# EasyEDA Pro project SAKANA_PCB.epro

# Schematic INA219
Board Name: INA219; Create Date: 2024-12-30; Page Name: P1; Project Name: SAKANA; Schematic Name: INA219; Update Date: 2024-12-30; Company: BSJ INSTRUMENT; Page Size: A5; Version: V1.0
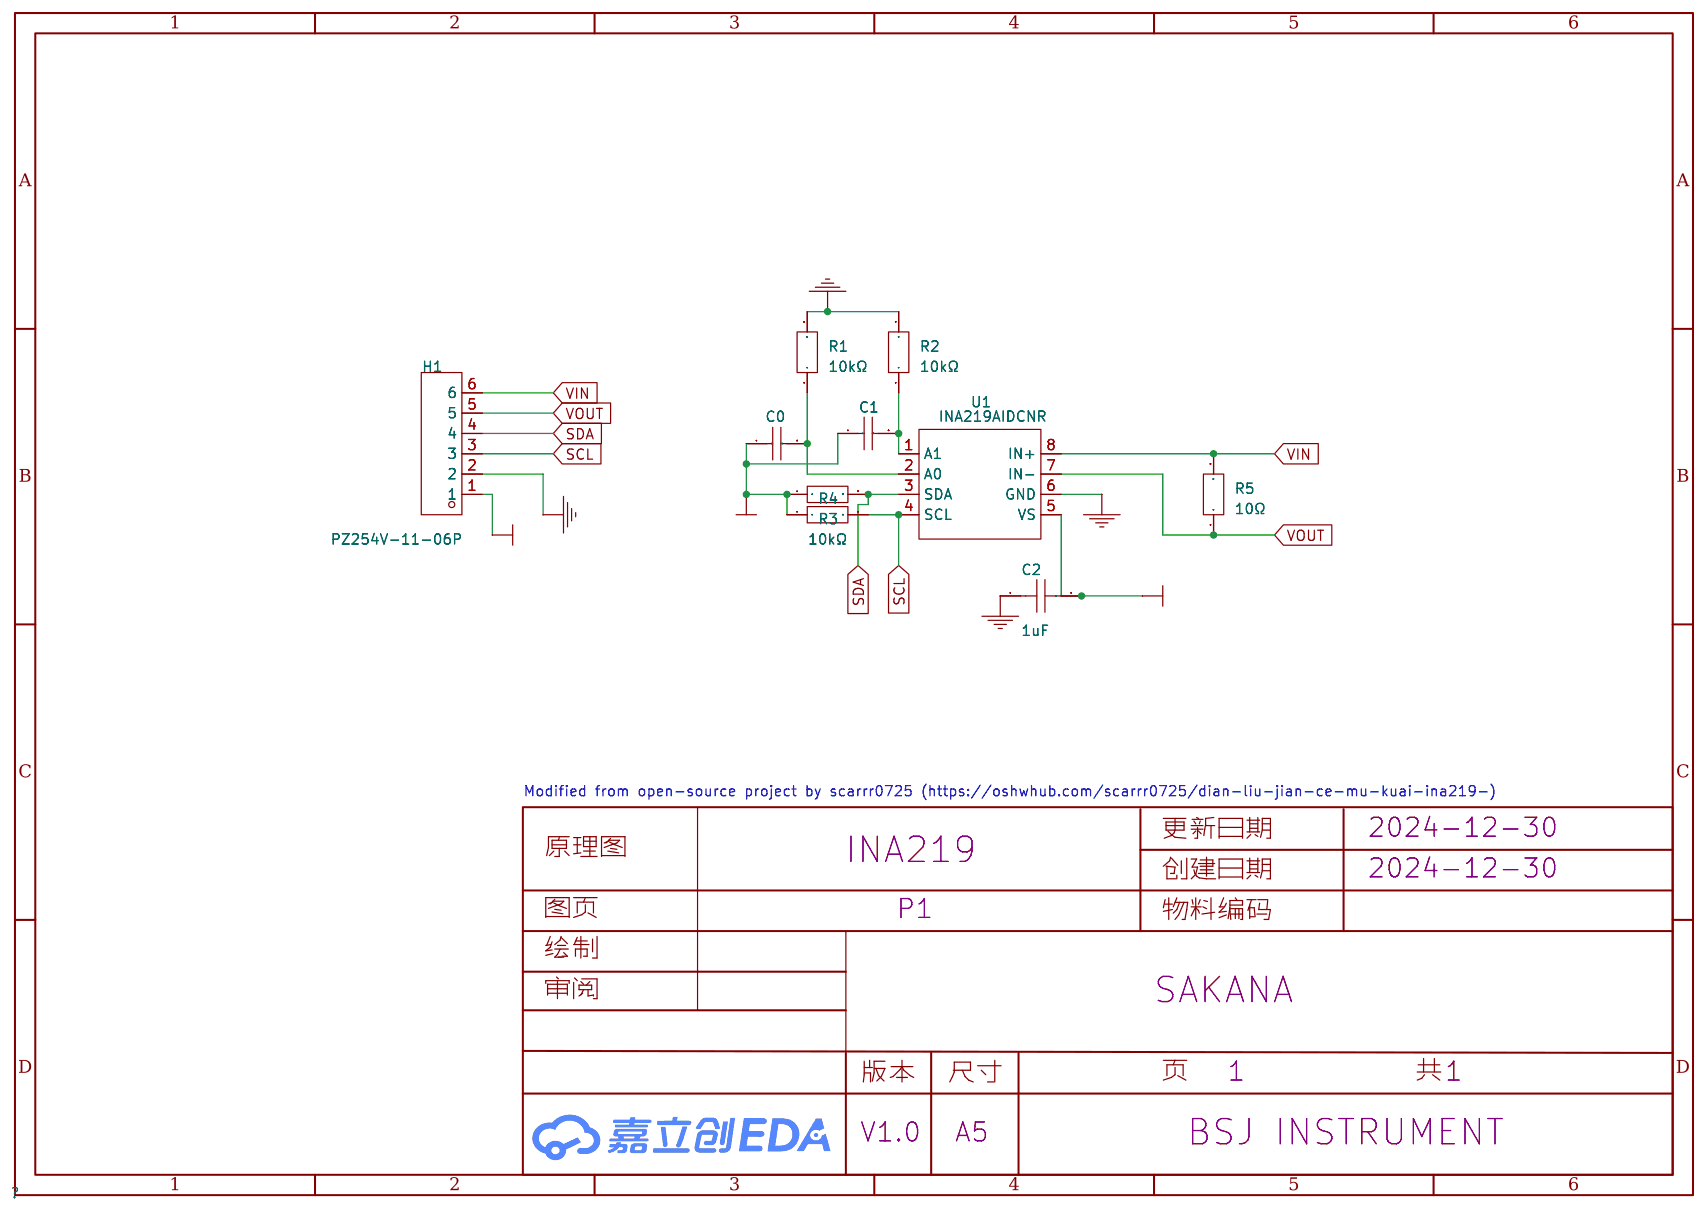
[diagram p0: schematic sheet]

## Parts
C0  1uF  [CAP-TH_L8.5-W5.0-P5.00-D1.2]
C1  1uF  [CAP-TH_L8.5-W5.0-P5.00-D1.2]
C2  1uF  [CAP-TH_L8.5-W5.0-P5.00-D1.2]
H1  PZ254V-11-06P  [HDR-TH_6P-P2.54-V-M]
R1  10kΩ  [RES-TH_BD2.7-L6.2-P10.20-D0.4]
R2  10kΩ  [RES-TH_BD2.7-L6.2-P10.20-D0.4]
R3  10kΩ  [RES-TH_BD2.7-L6.2-P10.20-D0.4]
R4  10K  [RES-TH_BD2.7-L6.2-P10.20-D0.4]
R5  10Ω  [RES-TH_BD2.7-L6.2-P10.20-D0.4]
U1  INA219AIDCNR  [SOIC-8_L4.9-W3.9-P1.27-LS6.0-BL]

## Library data of the parts
C0 C1 = 1uF: Supplier: LCSC; Manufacturer Part: CL10A105KB8NNNC; Manufacturer: SAMSUNG; Supplier Part: C15849; JLCPCB Part Class: Basic
C2 = CT4-0805B104K500F3: 容值:100nF;精度:±10%;额定电压:50V;温度系数:X7R;; LCSC Part Name: 100nF ±10% 50V C3型（直脚）; Supplier Part: C84772; Manufacturer: FH(风华); Supplier Footprint: 插件,P=5.08mm; JLCPCB Part Class: 扩展库; Datasheet: https://atta.szlcsc.com/upload/public/pdf/source/20190402/C385200_059806A6312B28FF1421A2413EB641E1.pdf; Supplier: LCSC; Tolerance: ±10%; Voltage Rated: 50V; Temperature Coefficient: X7R
H1 = PZ254V-11-06P: 插针结构:1x6P;间距:2.54mm;行距:-;圆针/方针:方针;安装类型:直插;排数:单排;总PIN位数:6P;额定电流:-;额定电压:-;配合针长度:6mm;塑高:2.5mm;端接针长度:3mm;触头材质:黄铜;触头镀层:-;工作温度范围:-40℃~+105℃;颜色:黑色;; LCSC Part Name: 间距:2.54mm 1x6P 直插 方针; Supplier Part: C492405; Manufacturer: XFCN(兴飞); Supplier Footprint: 插件,P=2.54mm; JLCPCB Part Class: 扩展库; Datasheet: https://atta.szlcsc.com/upload/public/pdf/source/20200309/C492405_597F1930F5B55CC3C7FD95458F1C3977.pdf; Supplier: LCSC; Pin Structure: 1x6P; Pitch: 2.54mm; Circluar Pins/Square Pins: 方针; Mounting Type: 直插; Number of Rows: 单排; Number of Pins: 6P; Length of Mating Pin: 6mm; Insulation Height: 2.5mm; Length of End Connection Pin: 3mm; Contact Material: 黄铜; Operating Temperature Range: -40℃~+105℃; Color: 黑色
R1 R2 R5 = MF1/4W-1K±1%-ST52: 电阻类型:金属膜电阻;阻值:1kΩ;精度:±1%;功率:250mW;温度系数:±100ppm/℃;; LCSC Part Name: 金属膜电阻 1kΩ ±1% 250mW; Supplier Part: C2903245; Manufacturer: VO(翔胜); Supplier Footprint: 插件,D2.7xL6.2mm; JLCPCB Part Class: 扩展库; Datasheet: https://atta.szlcsc.com/upload/public/pdf/source/20200609/C601728_5AA4C0C8E12E11069DA2C3356F29D1F2.pdf; Supplier: LCSC; Type: 金属膜电阻; Tolerance: ±1%; Overload Voltage (Max): 250V; Power(Watts): 250mW; Temperature Coefficient: ±100ppm/℃; Operating Temperature Range: -55℃~+155℃
R3 R4 = 10K: Supplier: LCSC; Manufacturer Part: TC0325B1002T5E; Manufacturer: UniOhm; Supplier Part: C39050; JLCPCB Part Class: Extend
U1 = INA219AIDCNR: Supplier: LCSC; Manufacturer: TI; Supplier Part: C87469; JLCPCB Part Class: Extend

## Nets
+5V: C0.1 C1.1 C2.2 H1.1 R3.1 R4.1 U1.5(VS)
GND: C2.1 H1.2 R1.2 R2.2 U1.6(GND)
VIN: H1.6 R5.2 U1.8(IN+)
SCL: H1.3 R3.2 U1.4(SCL)
SDA: H1.4 R4.2 U1.3(SDA)
VOUT: H1.5 R5.1 U1.7(IN-)
Net-(C0-2): C0.2 R1.1 U1.2(A0)
Net-(C1-2): C1.2 R2.1 U1.1(A1)

## Notes on the sheet
- Modified from open-source project by scarrr0725 (https://oshwhub.com/scarrr0725/dian-liu-jian-ce-mu-kuai-ina219-)

# Schematic Main
Board Name: Main; Create Date: 2024-12-29; Page Name: P1; Project Name: SAKANA; Schematic Name: Main; Update Date: 2025-02-17; Company: BSJ INSTRUMENT; Page Size: A4; Version: V1.0
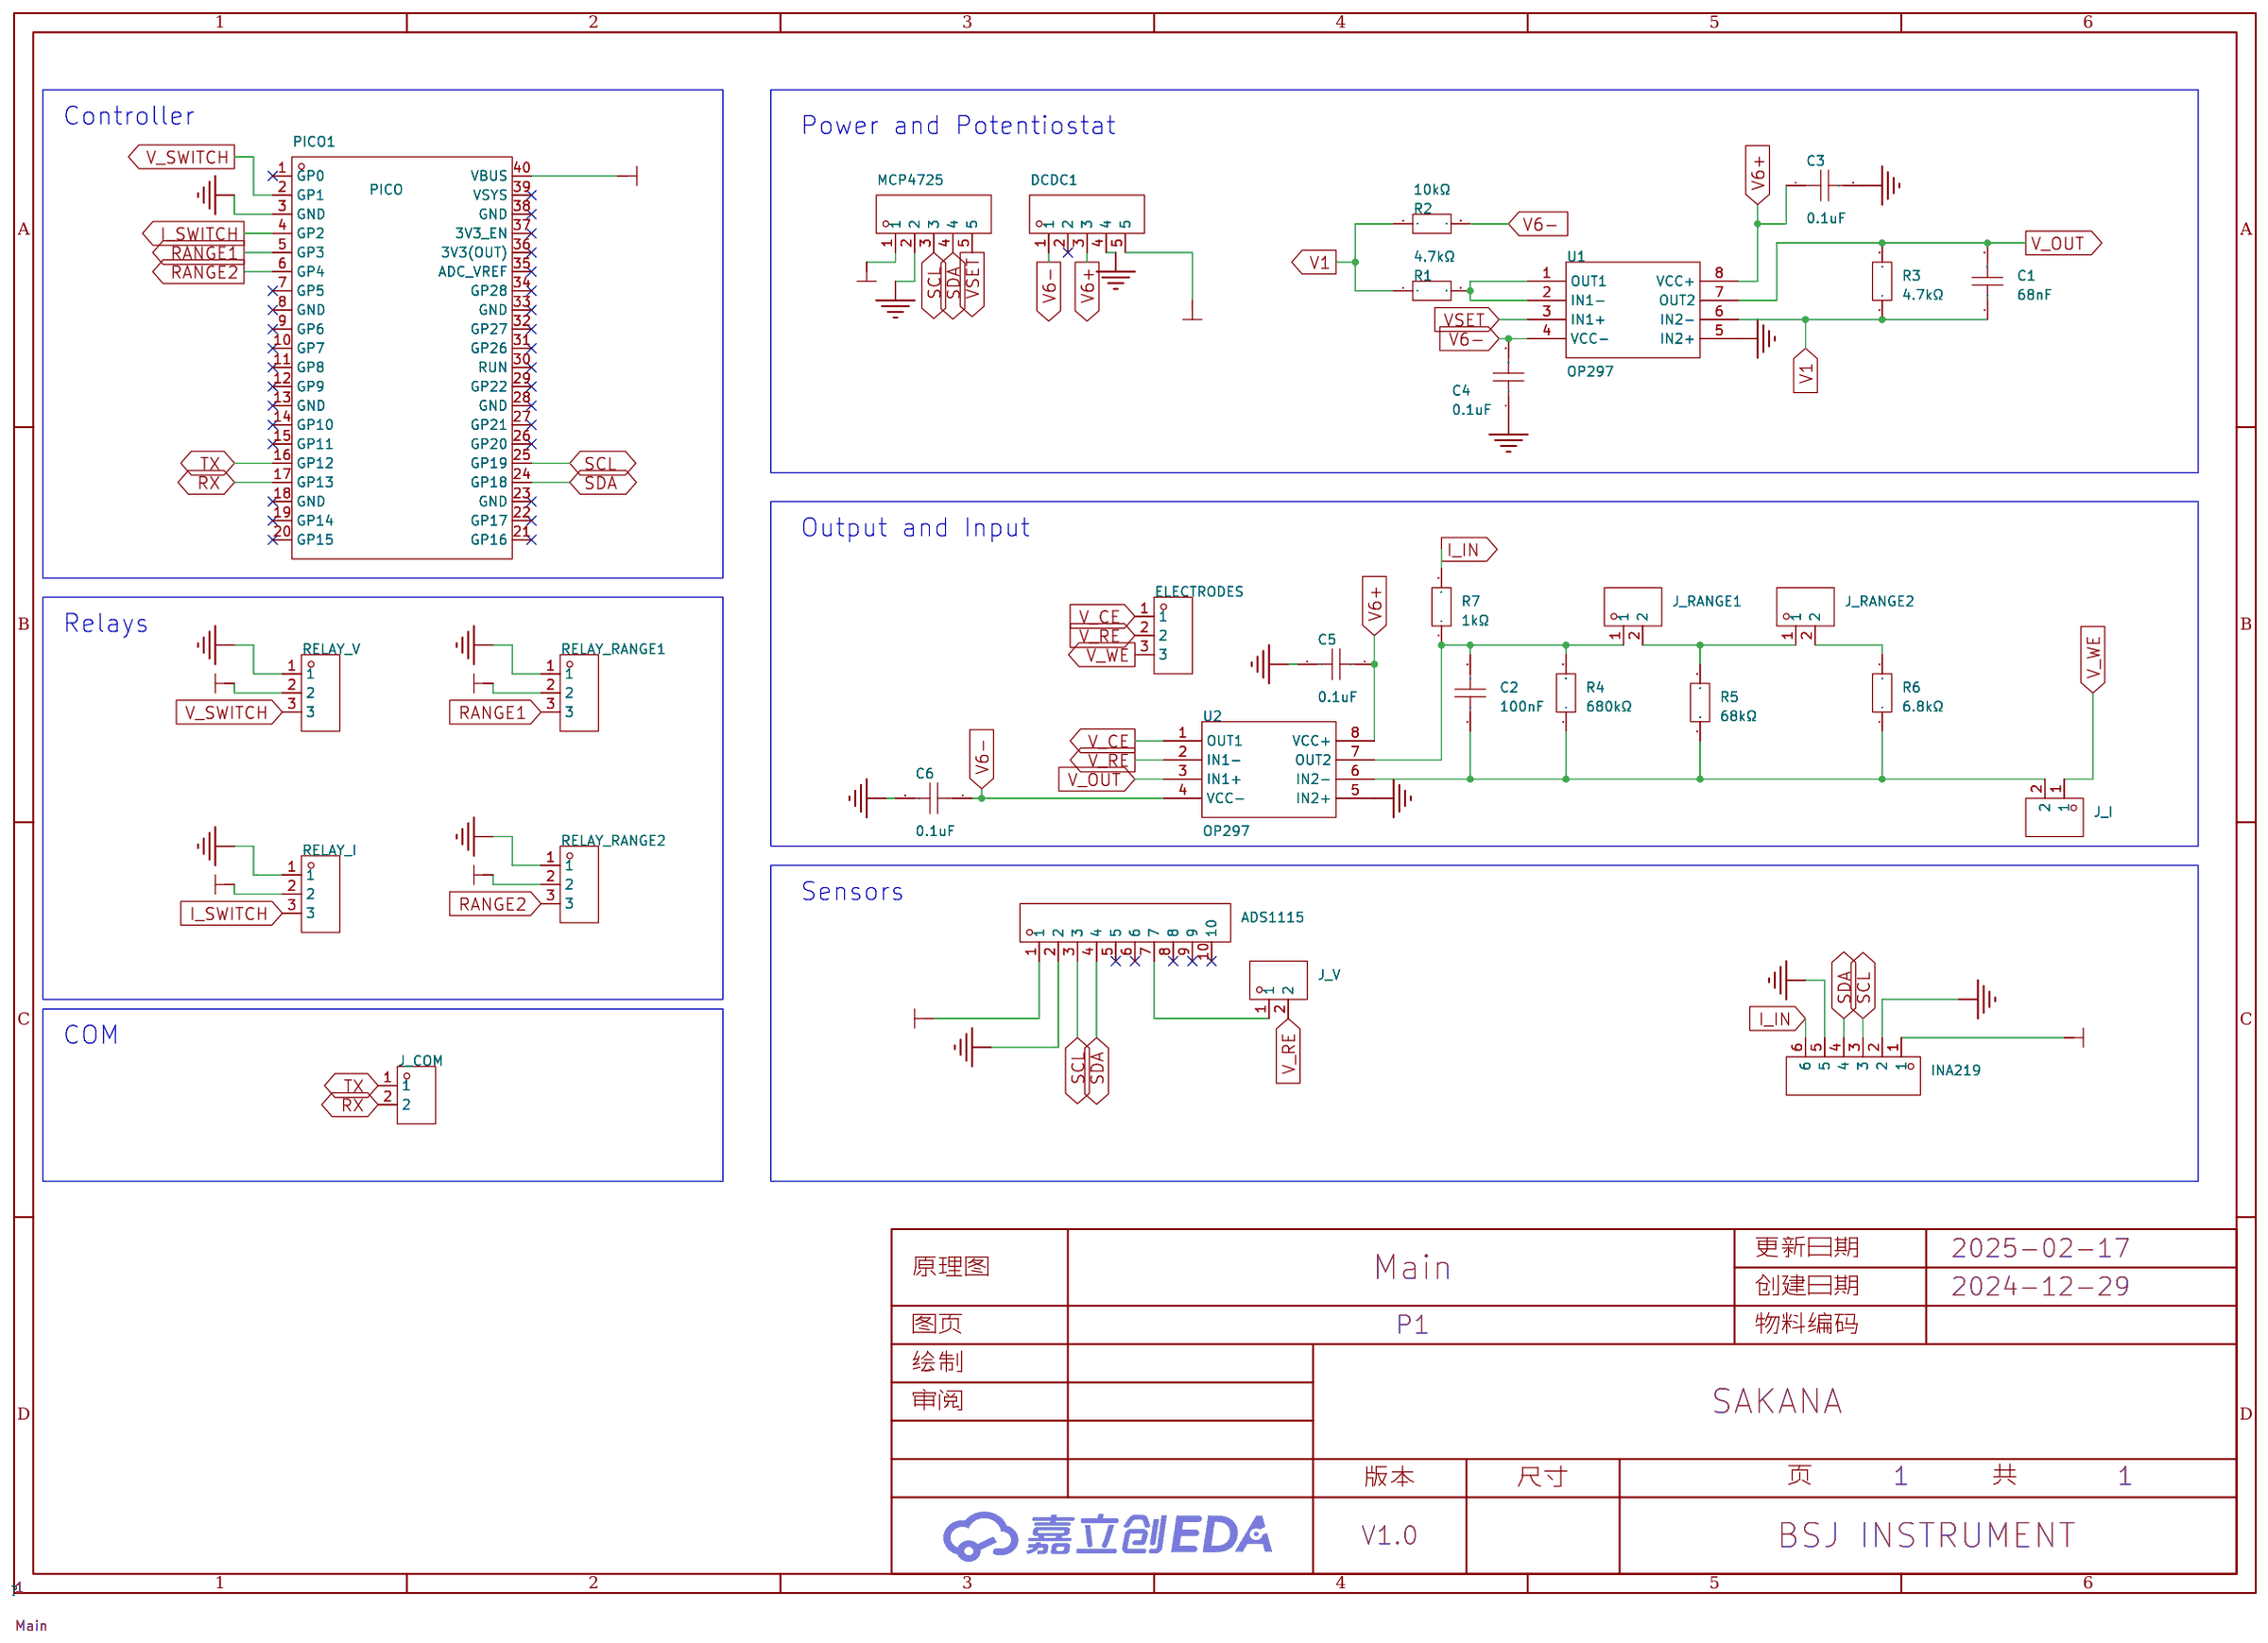
[diagram p1: schematic sheet]

## Parts
ADS1115  HDR1X10  [ADS1115Module]
C1  68nF  [CAP-TH_L10.0-W2.5-P5.15-D0.8]
C2  100nF  [CAP-TH_L10.0-W2.5-P5.15-D0.8]
C3  0.1uF  [CAP-TH_L10.0-W2.5-P5.15-D0.8]
C4  0.1uF  [CAP-TH_L10.0-W2.5-P5.15-D0.8]
C5  0.1uF  [CAP-TH_L10.0-W2.5-P5.15-D0.8]
C6  0.1uF  [CAP-TH_L10.0-W2.5-P5.15-D0.8]
DCDC1  PZ254V-11-05P  [DCDCModule]
ELECTRODES  排母2.54mm 1X3pin  [HDR-TH_3P-P2.54_CS-1165SDIG]
INA219  KH-2.54FH90-1X6P-H8.5  [INA219Module]
J_COM  HDR1X2  [HDR-TH_2P-P2.54-V-M-1]
J_I  HDR1X2  [HDR-TH_2P-P2.54-V-M-1]
J_RANGE1  HDR1X2  [HDR-TH_2P-P2.54-V-M-1]
J_RANGE2  HDR1X2  [HDR-TH_2P-P2.54-V-M-1]
J_V  HDR1X2  [HDR-TH_2P-P2.54-V-M-1]
MCP4725  PZ254V-11-05P  [MCP4725Module]
PICO1  PICO  [PICO直插]
R1  4.7kΩ  [RES-TH_BD2.7-L6.2-P10.20-D0.4]
R2  10kΩ  [RES-TH_BD2.7-L6.2-P10.20-D0.4]
R3  4.7kΩ  [RES-TH_BD2.7-L6.2-P10.20-D0.4]
R4  680kΩ  [RES-TH_BD2.7-L6.2-P10.20-D0.4]
R5  68kΩ  [RES-TH_BD2.7-L6.2-P10.20-D0.4]
R6  6.8kΩ  [RES-TH_BD2.7-L6.2-P10.20-D0.4]
R7  1kΩ  [RES-TH_BD2.7-L6.2-P10.20-D0.4]
RELAY_I  排母2.54mm 1X3pin  [RELAYModule]
RELAY_RANGE1  排母2.54mm 1X3pin  [RELAYModule]
RELAY_RANGE2  排母2.54mm 1X3pin  [RELAYModule]
RELAY_V  排母2.54mm 1X3pin  [RELAYModule]
U1  OP297  [PDIP-8_L9.6-W6.4-P2.54-LS7.6-BL-1]
U2  OP297  [PDIP-8_L9.6-W6.4-P2.54-LS7.6-BL-1]

## Library data of the parts
ADS1115 = HDR1X10: Supplier Part: C9900008052; Supplier Footprint: 1X10P2.54mm塑高3.5mm; JLCPCB Part Class: 扩展库; Supplier: LCSC
C1-C6 = CC1H104ZA1FD3F6C1100: 容值:100nF;精度:-20%~+80%;额定电压:50V;温度系数:Y5V;; LCSC Part Name: 100nF -20%~+80% 50V; Supplier Part: C5442939; Manufacturer: Dersonic(德尔创); Supplier Footprint: 插件,P=2.54mm; JLCPCB Part Class: 扩展库; Datasheet: https://atta.szlcsc.com/upload/public/pdf/source/20240808/2E4F22AECAD8A963CB56DA9A5AABDB6C.pdf; Supplier: LCSC; Tolerance: -20%~+80%; Voltage Rated: 50V; Lead Spacing: 2.54mm; Temperature Coefficient: Y5V; Diameter: 6.3mm; Body Thickness: 2.6mm
DCDC1 MCP4725 = PZ254V-11-05P: 插针结构:1x5P;间距:2.54mm;行距:-;圆针/方针:方针;安装类型:直插;排数:单排;总PIN位数:5P;额定电流:-;额定电压:-;配合针长度:6mm;塑高:2.5mm;端接针长度:3mm;触头材质:黄铜;触头镀层:-;工作温度范围:-40℃~+105℃;颜色:黑色;; LCSC Part Name: 间距:2.54mm 1x5P 直插 方针; Supplier Part: C492404; Manufacturer: XFCN(兴飞); Supplier Footprint: 插件,P=2.54mm; JLCPCB Part Class: 扩展库; Datasheet: https://atta.szlcsc.com/upload/public/pdf/source/20200309/C492404_E51533260F8710EFF5D4617281164C1D.pdf; Supplier: LCSC; Pin Structure: 1x5P; Pitch: 2.54mm; Circluar Pins/Square Pins: 方针; Mounting Type: 直插; Number of Rows: 单排; Number of Pins: 5P; Length of Mating Pin: 6mm; Insulation Height: 2.5mm; Length of End Connection Pin: 3mm; Contact Material: 黄铜; Operating Temperature Range: -40℃~+105℃; Color: 黑色
ELECTRODES RELAY_I RELAY_RANGE1 RELAY_RANGE2 RELAY_V = 排母2.54mm 1X3pin: Supplier Part: C9900016709; JLCPCB Part Class: 扩展库; Supplier: LCSC
INA219 = KH-2.54FH90-1X6P-H8.5: 插孔结构:1x6P;间距:2.54mm;行距:-;圆孔/方孔:方孔;安装类型:弯插;排数:单排;总孔位数:6P;额定电流:3A;额定电压:-;插孔方向:侧面;塑高:8.5mm;工作温度范围:-40℃~+105℃;; LCSC Part Name: 间距:2.54mm 1x6P 弯插; Supplier Part: C2932681; Manufacturer: kinghelm(金航标); Supplier Footprint: 弯插,P=2.54mm; JLCPCB Part Class: 扩展库; Datasheet: https://atta.szlcsc.com/upload/public/pdf/source/20211220/525C1B6496826BAEA2630695935DC58D.pdf; Supplier: LCSC; Holes Structure: 1x6P; Pitch: 2.54mm; Circular Hole / Square Hole: 方孔; Mounting Type: 弯插; Number of Rows: 单排; Number of Holes: 6P; Current Rating (Max): 3A; Holes Direction: 侧面; Insulation Height: 8.5mm; Operating Temperature Range: -40℃~+105℃
J_COM J_I J_RANGE1 J_RANGE2 J_V = HDR1X2: Supplier Part: C9900014921; Supplier Footprint: 排针; JLCPCB Part Class: 扩展库; Supplier: LCSC
PICO1 = PICO: "基于Raspberry Pi RP2040芯片设计；处理器：双核Arm Cortex-M0+ @ 133MHz内存：264KB片上SRAM；2MB板上QSPI闪存接口：26个GPIO引脚，包括3个模拟输入；2 × UART；2 × SPI控制器；2 × I2C控制器；16个PWM通道；1 × USB 1.1控制器和PHY，支持主机和设备；8 × PIO状态机"; Supplier Part: C7203002; Manufacturer: Raspberry Pi(树莓派); JLCPCB Part Class: 扩展库; Datasheet: https://atta.szlcsc.com/upload/public/pdf/source/20230906/086376002DDC9866828648BC93E51F8B.pdf; Supplier: LCSC
R1-R7 = MF1/4W-1K±1%-ST52: 电阻类型:金属膜电阻;阻值:1kΩ;精度:±1%;功率:250mW;温度系数:±100ppm/℃;; LCSC Part Name: 金属膜电阻 1kΩ ±1% 250mW; Supplier Part: C2903245; Manufacturer: VO(翔胜); Supplier Footprint: 插件,D2.7xL6.2mm; JLCPCB Part Class: 扩展库; Datasheet: https://atta.szlcsc.com/upload/public/pdf/source/20200609/C601728_5AA4C0C8E12E11069DA2C3356F29D1F2.pdf; Supplier: LCSC; Type: 金属膜电阻; Tolerance: ±1%; Overload Voltage (Max): 250V; Power(Watts): 250mW; Temperature Coefficient: ±100ppm/℃; Operating Temperature Range: -55℃~+155℃
U1 U2 = NE5532PE4: 放大器数:双路;增益带宽积(GBP):10MHz;输入偏置电流(Ib):200nA;压摆率(SR):9V/us;带宽(-3db):-;; Supplier Part: C1347122; Manufacturer: TI(德州仪器); Supplier Footprint: PDIP-8; JLCPCB Part Class: 扩展库; Datasheet: https://www.ti.com/cn/lit/gpn/sa5532; Supplier: LCSC; Number of Circuits: 双路; Gain Bandwidth Product(GBP): 10MHz; Current - Input Bias(Ib): 200nA; Slew Rate(SR): 9V/us; Output Current: 38mA; Operating Temperature: 0℃~+70℃

## Nets
GND: ADS1115.2 C3.2 C4.1 C5.2 C6.2 DCDC1.4 INA219.2 INA219.5 MCP4725.2 PICO1.3(GND) RELAY_I.1 RELAY_RANGE1.1 RELAY_RANGE2.1 RELAY_V.1 U1.5(IN2+) U2.5(IN2+)
V1: C1.1 R1.1 R2.1 R3.1 U1.6(IN2-)
V6+: C3.1 C5.1 DCDC1.3 U1.8(VCC+) U2.8(VCC+)
V6-: C4.2 C6.1 DCDC1.1 R2.2 U1.4(VCC-) U2.4(VCC-)
VCC: ADS1115.1 DCDC1.5 INA219.1 MCP4725.1 PICO1.40(VBUS) RELAY_I.2 RELAY_RANGE1.2 RELAY_RANGE2.2 RELAY_V.2
I_IN: INA219.6 R7.2
I_SWITCH: PICO1.4(GP2) RELAY_I.3
RANGE1: PICO1.5(GP3) RELAY_RANGE1.3
RANGE2: PICO1.6(GP4) RELAY_RANGE2.3
RX: J_COM.2 PICO1.17(GP13)
SCL: ADS1115.3 INA219.3 MCP4725.3 PICO1.25(GP19)
SDA: ADS1115.4 INA219.4 MCP4725.4 PICO1.24(GP18)
TX: J_COM.1 PICO1.16(GP12)
V_CE: ELECTRODES.1 U2.1(OUT1)
V_OUT: C1.2 R3.2 U1.7(OUT2) U2.3(IN1+)
V_RE: ELECTRODES.2 J_V.2 U2.2(IN1-)
V_SWITCH: PICO1.2(GP1) RELAY_V.3
V_WE: ELECTRODES.3 J_I.1
VSET: MCP4725.5 U1.3(IN1+)
$1N2928: R1.2 U1.1(OUT1) U1.2(IN1-)
$1N3893: C2.1 J_I.2 R4.1 R5.2 R6.1 U2.6(IN2-)
$1N3984: C2.2 J_RANGE1.1 R4.2 R7.1 U2.7(OUT2)
$1N5030: ADS1115.7 J_V.1
$1N11195: J_RANGE1.2 J_RANGE2.1 R5.1
$1N11201: J_RANGE2.2 R6.2

Not connected (* = marked no-connect by the designer): ADS1115 5* 6* 8* 9* 10*; DCDC1 2*; PICO1 1(GP0)* 7(GP5)* 8(GND)* 9(GP6)* 10(GP7)* 11(GP8)* 12(GP9)* 13(GND)* 14(GP10)* 15(GP11)* 18(GND)* 19(GP14)* 20(GP15)* 21(GP16)* 22(GP17)* 23(GND)* 26(GP20)* 27(GP21)* 28(GND)* 29(GP22)* 30(RUN)* 31(GP26)* 32(GP27)* 33(GND)* 34(GP28)* 35(ADC_VREF)* 36(3V3(OUT))* 37(3V3_EN)* 38(GND)* 39(VSYS)*

## Notes on the sheet
- Controller
- Power and Potentiostat
- Output and Input
- Relays
- Sensors
- COM

# Schematic Main_3
Board Name: LDO_v2; Create Date: 2025-10-01; Page Name: P1; Project Name: SAKANA; Schematic Name: Main_3; Update Date: 2025-11-12; Company: BSJ INSTRUMENT; Page Size: A4; Version: V1.0
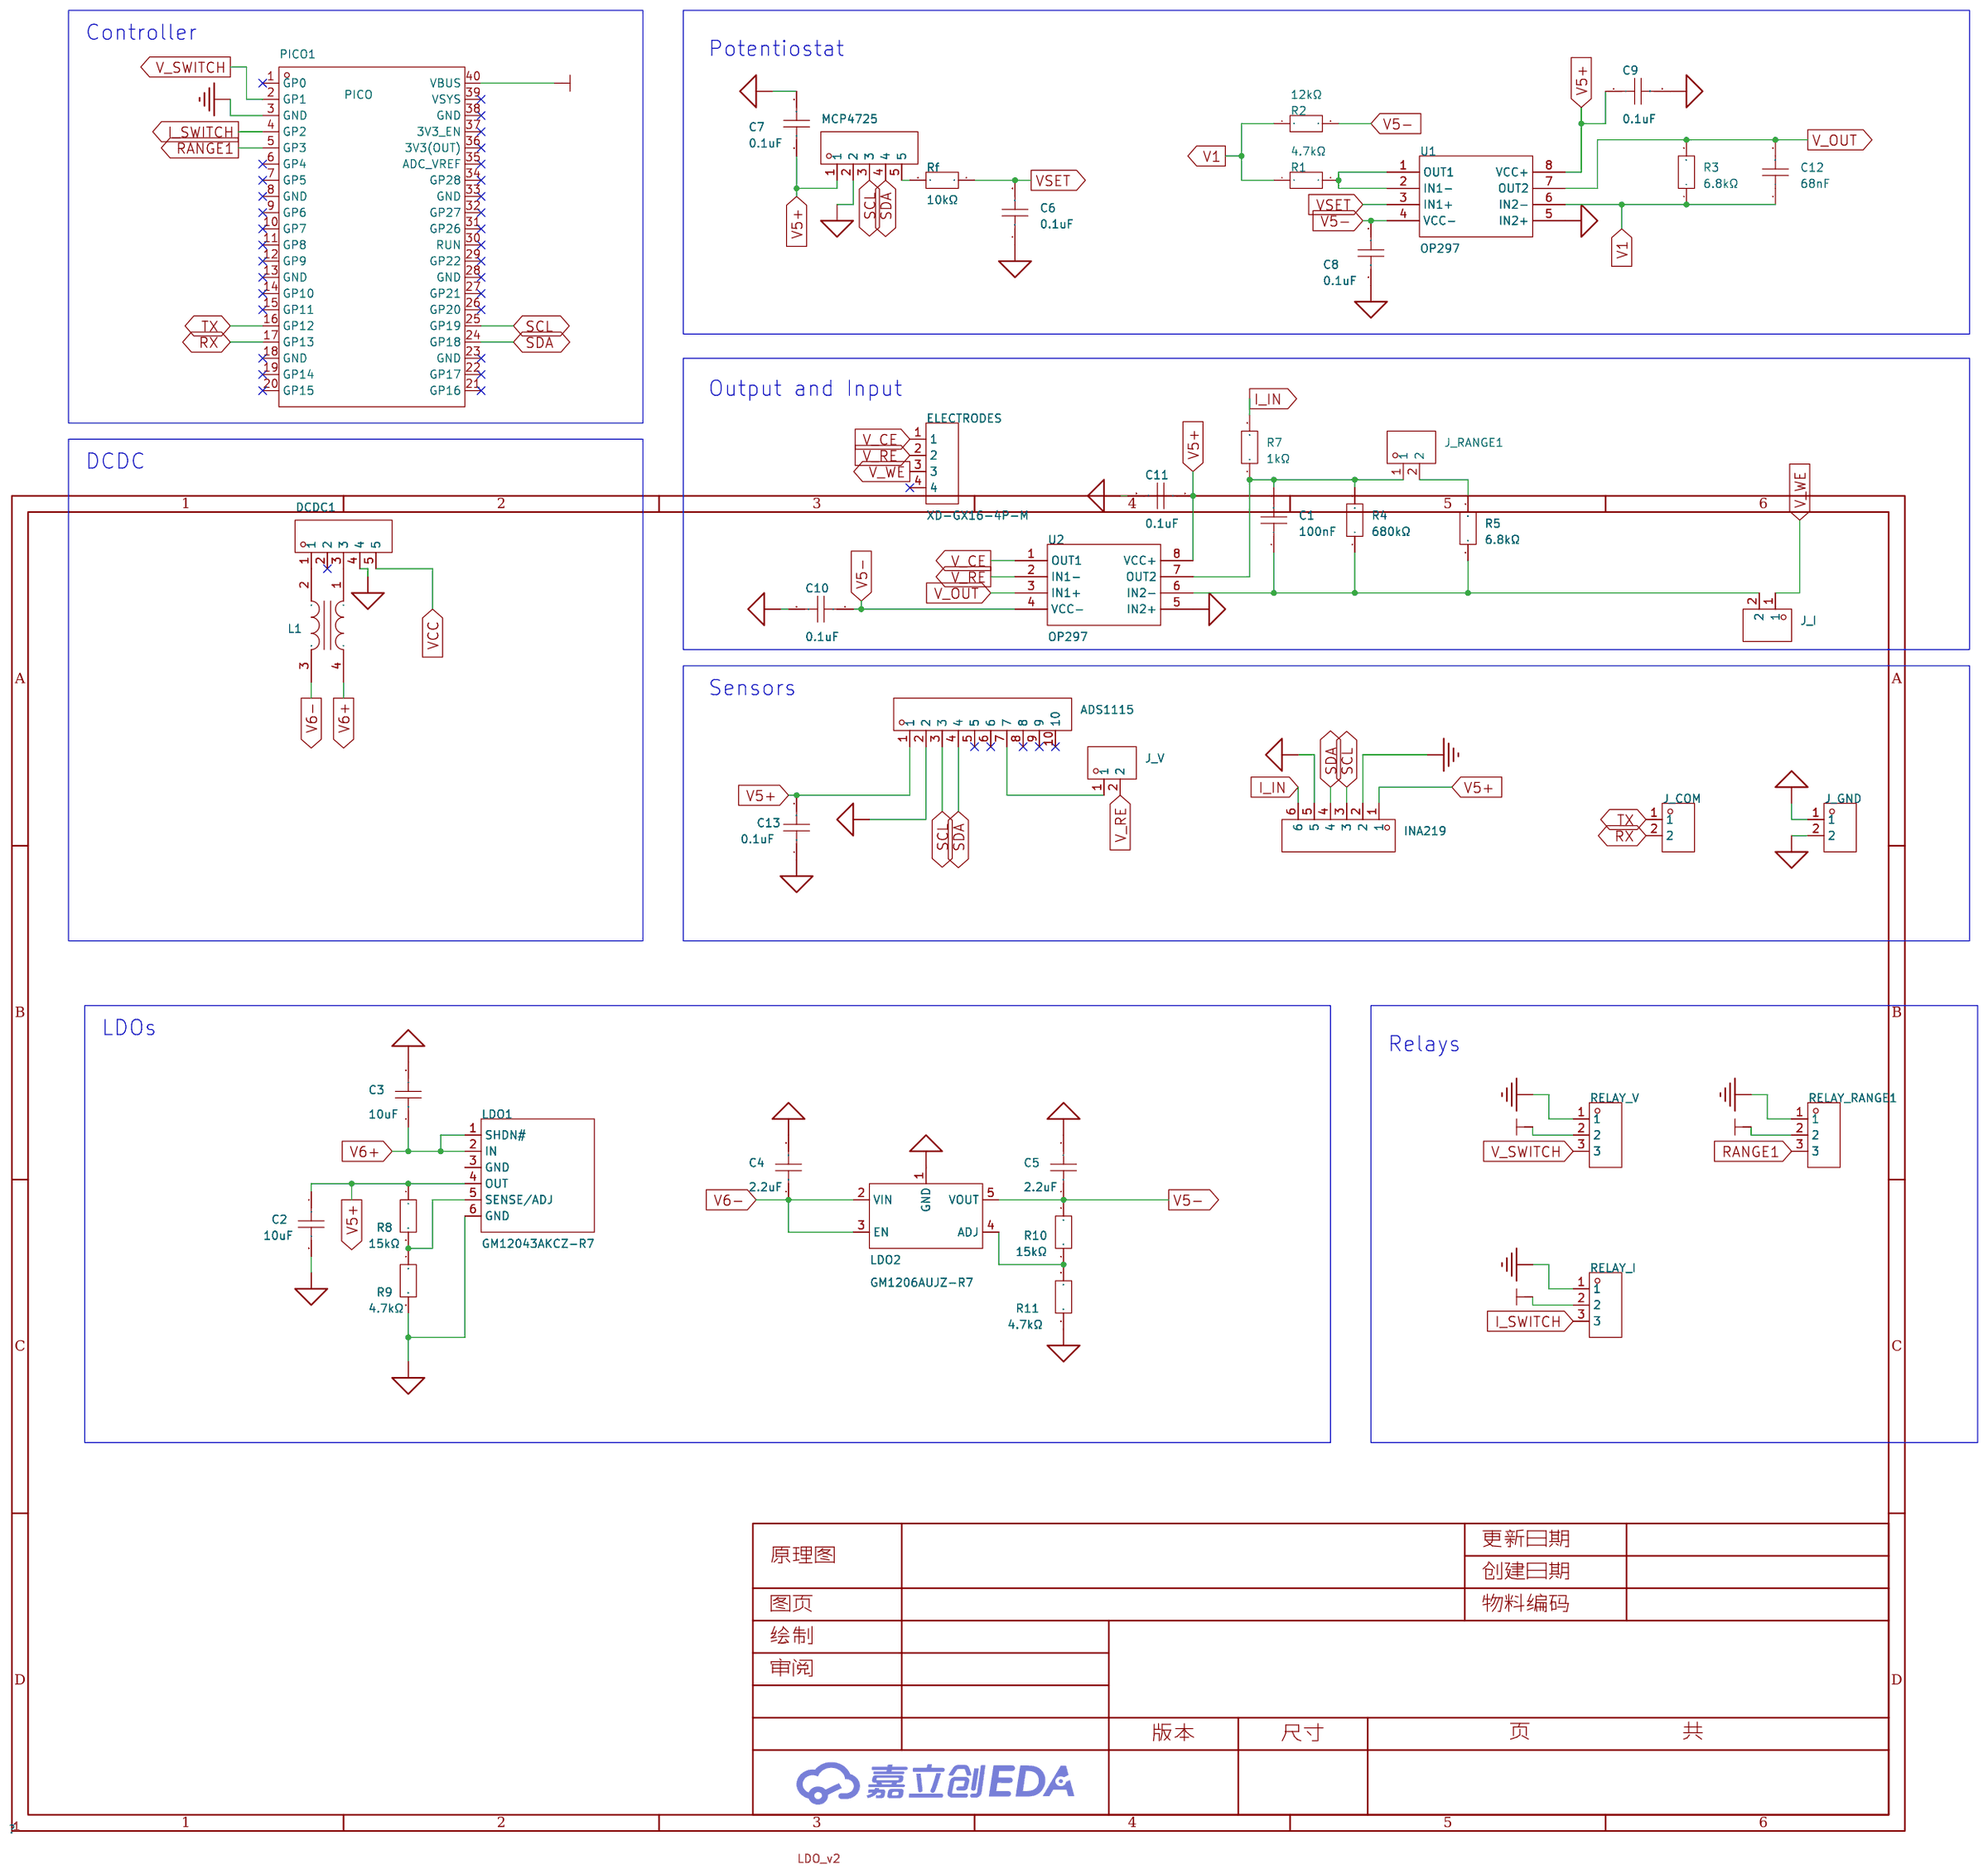
[diagram p2: schematic sheet]

## Parts
ADS1115  HDR1X10  [ADS1115Module]
C1  100nF  [CAP-TH_L10.0-W2.5-P5.15-D0.8]
C2  10uF  [CAP-TH_L10.0-W2.5-P5.15-D0.8]
C3  10uF  [CAP-TH_L10.0-W2.5-P5.15-D0.8]
C4  2.2uF  [CAP-TH_L10.0-W2.5-P5.15-D0.8]
C5  2.2uF  [CAP-TH_L10.0-W2.5-P5.15-D0.8]
C6  0.1uF  [CAP-TH_L10.0-W2.5-P5.15-D0.8]
C7  0.1uF  [CAP-TH_L10.0-W2.5-P5.15-D0.8]
C8  0.1uF  [CAP-TH_L10.0-W2.5-P5.15-D0.8]
C9  0.1uF  [CAP-TH_L10.0-W2.5-P5.15-D0.8]
C10  0.1uF  [CAP-TH_L10.0-W2.5-P5.15-D0.8]
C11  0.1uF  [CAP-TH_L10.0-W2.5-P5.15-D0.8]
C12  68nF  [CAP-TH_L10.0-W2.5-P5.15-D0.8]
C13  0.1uF  [CAP-TH_L10.0-W2.5-P5.15-D0.8]
DCDC1  PZ254V-11-05P  [DCDCModule]
ELECTRODES  XD-GX16-4P-M  [CONN-TH_XD-GX16-4P-M]
INA219  KH-2.54FH90-1X6P-H8.5  [INA219Module]
J_COM  HDR1X2  [HDR-TH_2P-P2.54-V-M-1]
J_GND  HDR1X2  [HDR-TH_2P-P2.54-V-M-1]
J_I  HDR1X2  [HDR-TH_2P-P2.54-V-M-1]
J_RANGE1  HDR1X2  [HDR-TH_2P-P2.54-V-M-1]
J_V  HDR1X2  [HDR-TH_2P-P2.54-V-M-1]
L1  SMCM7060-102T  [FILTER-SMD_4P-L7.0-W6.0-TL_SMCM7060]
LDO1  GM12043AKCZ-R7  [SOT-223-6_L6.5-W3.5-P1.27-LS7.0-BR]
LDO2  GM1206AUJZ-R7  [SOT-23-5_L2.9-W1.6-P0.95-LS2.8-BR]
MCP4725  PZ254V-11-05P  [MCP4725Module]
PICO1  PICO  [PICO直插]
R1  4.7kΩ  [RES-TH_BD2.7-L6.2-P10.20-D0.4]
R2  12kΩ  [RES-TH_BD2.7-L6.2-P10.20-D0.4]
R3  6.8kΩ  [RES-TH_BD2.7-L6.2-P10.20-D0.4]
R4  680kΩ  [RES-TH_BD2.7-L6.2-P10.20-D0.4]
R5  6.8kΩ  [RES-TH_BD2.7-L6.2-P10.20-D0.4]
R7  1kΩ  [RES-TH_BD2.7-L6.2-P10.20-D0.4]
R8  15kΩ  [RES-TH_BD2.7-L6.2-P10.20-D0.4]
R9  4.7kΩ  [RES-TH_BD2.7-L6.2-P10.20-D0.4]
R10  15kΩ  [RES-TH_BD2.7-L6.2-P10.20-D0.4]
R11  4.7kΩ  [RES-TH_BD2.7-L6.2-P10.20-D0.4]
RELAY_I  排母2.54mm 1X3pin  [RELAYModule]
RELAY_RANGE1  排母2.54mm 1X3pin  [RELAYModule]
RELAY_V  排母2.54mm 1X3pin  [RELAYModule]
Rf  10kΩ  [RES-TH_BD2.7-L6.2-P10.20-D0.4]
U1  OP297  [PDIP-8_L9.6-W6.4-P2.54-LS7.6-BL-1]
U2  OP297  [PDIP-8_L9.6-W6.4-P2.54-LS7.6-BL-1]

## Library data of the parts
ADS1115 = HDR1X10: Supplier Part: C9900008052; Supplier Footprint: 1X10P2.54mm塑高3.5mm; JLCPCB Part Class: 扩展库; Supplier: LCSC
C1-C13 = CC1H104ZA1FD3F6C1100: 容值:100nF;精度:-20%~+80%;额定电压:50V;温度系数:Y5V;; LCSC Part Name: 100nF -20%~+80% 50V; Supplier Part: C5442939; Manufacturer: Dersonic(德尔创); Supplier Footprint: 插件,P=2.54mm; JLCPCB Part Class: 扩展库; Datasheet: https://atta.szlcsc.com/upload/public/pdf/source/20240808/2E4F22AECAD8A963CB56DA9A5AABDB6C.pdf; Supplier: LCSC; Tolerance: -20%~+80%; Voltage Rated: 50V; Lead Spacing: 2.54mm; Temperature Coefficient: Y5V; Diameter: 6.3mm; Body Thickness: 2.6mm
DCDC1 MCP4725 = PZ254V-11-05P: 插针结构:1x5P;间距:2.54mm;行距:-;圆针/方针:方针;安装类型:直插;排数:单排;总PIN位数:5P;额定电流:-;额定电压:-;配合针长度:6mm;塑高:2.5mm;端接针长度:3mm;触头材质:黄铜;触头镀层:-;工作温度范围:-40℃~+105℃;颜色:黑色;; LCSC Part Name: 间距:2.54mm 1x5P 直插 方针; Supplier Part: C492404; Manufacturer: XFCN(兴飞); Supplier Footprint: 插件,P=2.54mm; JLCPCB Part Class: 扩展库; Datasheet: https://atta.szlcsc.com/upload/public/pdf/source/20200309/C492404_E51533260F8710EFF5D4617281164C1D.pdf; Supplier: LCSC; Pin Structure: 1x5P; Pitch: 2.54mm; Circluar Pins/Square Pins: 方针; Mounting Type: 直插; Number of Rows: 单排; Number of Pins: 5P; Length of Mating Pin: 6mm; Insulation Height: 2.5mm; Length of End Connection Pin: 3mm; Contact Material: 黄铜; Operating Temperature Range: -40℃~+105℃; Color: 黑色
ELECTRODES = XD-GX16-4P-M: Supplier Part: C22392643; Manufacturer: XUNDA(讯答); Supplier Footprint: 插件; JLCPCB Part Class: 扩展库; Datasheet: https://item.szlcsc.com/datasheet/XD-GX16-4P-M/23980922.html; Supplier: LCSC
INA219 = KH-2.54FH90-1X6P-H8.5: 插孔结构:1x6P;间距:2.54mm;行距:-;圆孔/方孔:方孔;安装类型:弯插;排数:单排;总孔位数:6P;额定电流:3A;额定电压:-;插孔方向:侧面;塑高:8.5mm;工作温度范围:-40℃~+105℃;; LCSC Part Name: 间距:2.54mm 1x6P 弯插; Supplier Part: C2932681; Manufacturer: kinghelm(金航标); Supplier Footprint: 弯插,P=2.54mm; JLCPCB Part Class: 扩展库; Datasheet: https://atta.szlcsc.com/upload/public/pdf/source/20211220/525C1B6496826BAEA2630695935DC58D.pdf; Supplier: LCSC; Holes Structure: 1x6P; Pitch: 2.54mm; Circular Hole / Square Hole: 方孔; Mounting Type: 弯插; Number of Rows: 单排; Number of Holes: 6P; Current Rating (Max): 3A; Holes Direction: 侧面; Insulation Height: 8.5mm; Operating Temperature Range: -40℃~+105℃
J_COM J_GND J_I J_RANGE1 J_V = HDR1X2: Supplier Part: C9900014921; Supplier Footprint: 排针; JLCPCB Part Class: 扩展库; Supplier: LCSC
L1 = SMCM7060-102T: 通道数:2;阻抗@频率:1.02kΩ;直流电阻(DCR):17mΩ;; LCSC Part Name: 两路 贴片共模滤波器 阻抗1.02kΩ@100MHz; Supplier Part: C381615; Manufacturer: SXN(顺翔诺); Supplier Footprint: SMD,7x6mm; JLCPCB Part Class: 扩展库; Datasheet: https://item.szlcsc.com/datasheet/SMCM7060-102T/354240.html; Supplier: LCSC; Number of Lines: 2; Current Rating: 3A; Voltage Rating - DC: 125V; Impedance @ Frequency: 1.02kΩ; DC Resistance(DCR): 17mΩ; Operating Temperature: -40℃~+125℃
LDO1 = GM12043AKCZ-R7: 输出类型:可调;工作电压:20V;输出电压:1.21V~20V;输出电流:1.5A;电源纹波抑制比(PSRR):68dB@(100Hz);输出极性:正极;; LCSC Part Name: 输入20V 输出可调 1.5A; Supplier Part: C7427503; Manufacturer: GONGMOSEMI(共模半导体); Supplier Footprint: SOT-223-6; JLCPCB Part Class: 扩展库; Datasheet: https://item.szlcsc.com/datasheet/GM12043AKCZ-R7/8421183.html; Supplier: LCSC; Output Type: 可调; Voltage - Supply: 20V; Output Voltage: 1.21V~20V; Output Current: 1.5A; Power Supply Rejection Ratio (PSRR): 68dB@(100Hz); Voltage Dropout: 160mV@(1.5A); standby current: 1mA; Noise: 20uVrms; Features: 过流保护；欠压锁定；带使能；过热保护；短路保护; Operating Temperature: -40℃~+125℃; Output Configuration: 正极; Number of Outputs: 1
LDO2 = GM1206AUJZ-R7: 输出类型:可调;工作电压:10V;输出电压:1.186V~10V;输出电流:200mA;电源纹波抑制比(PSRR):72dB@(10kHz)；57dB@(100kHz);输出极性:负极;; Supplier Part: C48641589; Manufacturer: GONGMOSEMI(共模半导体); Supplier Footprint: SOT-23; JLCPCB Part Class: 扩展库; Datasheet: https://item.szlcsc.com/datasheet/GM1206AUJZ-R7/50919536.html; Supplier: LCSC; Output Type: 可调; Voltage - Supply: 10V; Output Voltage: 1.186V~10V; Output Current: 200mA; Power Supply Rejection Ratio (PSRR): 72dB@(10kHz)；57dB@(100kHz); Voltage Dropout: 88mV@(200mA); standby current: 33uA; Noise: 10uVrms; Operating Temperature: -40℃~+125℃@(Tj); Output Configuration: 负极
PICO1 = PICO: "基于Raspberry Pi RP2040芯片设计；处理器：双核Arm Cortex-M0+ @ 133MHz内存：264KB片上SRAM；2MB板上QSPI闪存接口：26个GPIO引脚，包括3个模拟输入；2 × UART；2 × SPI控制器；2 × I2C控制器；16个PWM通道；1 × USB 1.1控制器和PHY，支持主机和设备；8 × PIO状态机"; Supplier Part: C7203002; Manufacturer: Raspberry Pi(树莓派); JLCPCB Part Class: 扩展库; Datasheet: https://atta.szlcsc.com/upload/public/pdf/source/20230906/086376002DDC9866828648BC93E51F8B.pdf; Supplier: LCSC
R1-R5 R7-R11 Rf = MF1/4W-1K±1%-ST52: 电阻类型:金属膜电阻;阻值:1kΩ;精度:±1%;功率:250mW;温度系数:±100ppm/℃;; LCSC Part Name: 金属膜电阻 1kΩ ±1% 250mW; Supplier Part: C2903245; Manufacturer: VO(翔胜); Supplier Footprint: 插件,D2.7xL6.2mm; JLCPCB Part Class: 扩展库; Datasheet: https://atta.szlcsc.com/upload/public/pdf/source/20200609/C601728_5AA4C0C8E12E11069DA2C3356F29D1F2.pdf; Supplier: LCSC; Type: 金属膜电阻; Tolerance: ±1%; Overload Voltage (Max): 250V; Power(Watts): 250mW; Temperature Coefficient: ±100ppm/℃; Operating Temperature Range: -55℃~+155℃
RELAY_I RELAY_RANGE1 RELAY_V = 排母2.54mm 1X3pin: Supplier Part: C9900016709; JLCPCB Part Class: 扩展库; Supplier: LCSC
U1 U2 = NE5532PE4: 放大器数:双路;增益带宽积(GBP):10MHz;输入偏置电流(Ib):200nA;压摆率(SR):9V/us;带宽(-3db):-;; Supplier Part: C1347122; Manufacturer: TI(德州仪器); Supplier Footprint: PDIP-8; JLCPCB Part Class: 扩展库; Datasheet: https://www.ti.com/cn/lit/gpn/sa5532; Supplier: LCSC; Number of Circuits: 双路; Gain Bandwidth Product(GBP): 10MHz; Current - Input Bias(Ib): 200nA; Slew Rate(SR): 9V/us; Output Current: 38mA; Operating Temperature: 0℃~+70℃

## Nets
GND: ADS1115.2 C2.2 C3.2 C4.2 C5.2 C6.1 C7.1 C8.1 C9.2 C10.2 C11.2 C13.1 DCDC1.4 INA219.2 INA219.5 J_GND.1 J_GND.2 LDO1.6(GND) LDO2.1(GND) MCP4725.2 PICO1.3(GND) R9.2 R11.2 RELAY_I.1 RELAY_RANGE1.1 RELAY_V.1 U1.5(IN2+) U2.5(IN2+)
V1: C12.1 R1.1 R2.1 R3.1 U1.6(IN2-)
V5+: ADS1115.1 C2.1 C7.2 C9.1 C11.1 C13.2 INA219.1 LDO1.4(OUT) MCP4725.1 R8.1 U1.8(VCC+) U2.8(VCC+)
V5-: C5.1 C8.2 C10.1 LDO2.5(VOUT) R2.2 R10.1 U1.4(VCC-) U2.4(VCC-)
V6+: C3.1 L1.4 LDO1.1(SHDN#) LDO1.2(IN)
V6-: C4.1 L1.3 LDO2.2(VIN) LDO2.3(EN)
VCC: DCDC1.5 PICO1.40(VBUS) RELAY_I.2 RELAY_RANGE1.2 RELAY_V.2
I_IN: INA219.6 R7.2
I_SWITCH: PICO1.4(GP2) RELAY_I.3
RANGE1: PICO1.5(GP3) RELAY_RANGE1.3
RX: J_COM.2 PICO1.17(GP13)
SCL: ADS1115.3 INA219.3 MCP4725.3 PICO1.25(GP19)
SDA: ADS1115.4 INA219.4 MCP4725.4 PICO1.24(GP18)
TX: J_COM.1 PICO1.16(GP12)
V_CE: ELECTRODES.1 U2.1(OUT1)
V_OUT: C12.2 R3.2 U1.7(OUT2) U2.3(IN1+)
V_RE: ELECTRODES.2 J_V.2 U2.2(IN1-)
V_SWITCH: PICO1.2(GP1) RELAY_V.3
V_WE: ELECTRODES.3 J_I.1
VSET: C6.2 Rf.1 U1.3(IN1+)
$1N2928: R1.2 U1.1(OUT1) U1.2(IN1-)
$1N3893: C1.1 J_I.2 R4.1 R5.2 U2.6(IN2-)
$1N3984: C1.2 J_RANGE1.1 R4.2 R7.1 U2.7(OUT2)
$1N5030: ADS1115.7 J_V.1
$1N11195: J_RANGE1.2 R5.1
$1N18407: DCDC1.1 L1.2
$1N18409: DCDC1.3 L1.1
$1N19473: MCP4725.5 Rf.2
$1N24230: LDO1.5(SENSE/ADJ) R8.2 R9.1
$1N24635: LDO2.4(ADJ) R10.2 R11.1

Not connected (* = marked no-connect by the designer): ADS1115 5* 6* 8* 9* 10*; DCDC1 2*; ELECTRODES 4*; LDO1 3(GND); PICO1 1(GP0)* 6(GP4)* 7(GP5)* 8(GND)* 9(GP6)* 10(GP7)* 11(GP8)* 12(GP9)* 13(GND)* 14(GP10)* 15(GP11)* 18(GND)* 19(GP14)* 20(GP15)* 21(GP16)* 22(GP17)* 23(GND)* 26(GP20)* 27(GP21)* 28(GND)* 29(GP22)* 30(RUN)* 31(GP26)* 32(GP27)* 33(GND)* 34(GP28)* 35(ADC_VREF)* 36(3V3(OUT))* 37(3V3_EN)* 38(GND)* 39(VSYS)*

## Notes on the sheet
- Controller
- Potentiostat
- Output and Input
- DCDC
- Sensors
- LDOs
- Relays

# Board PCB1
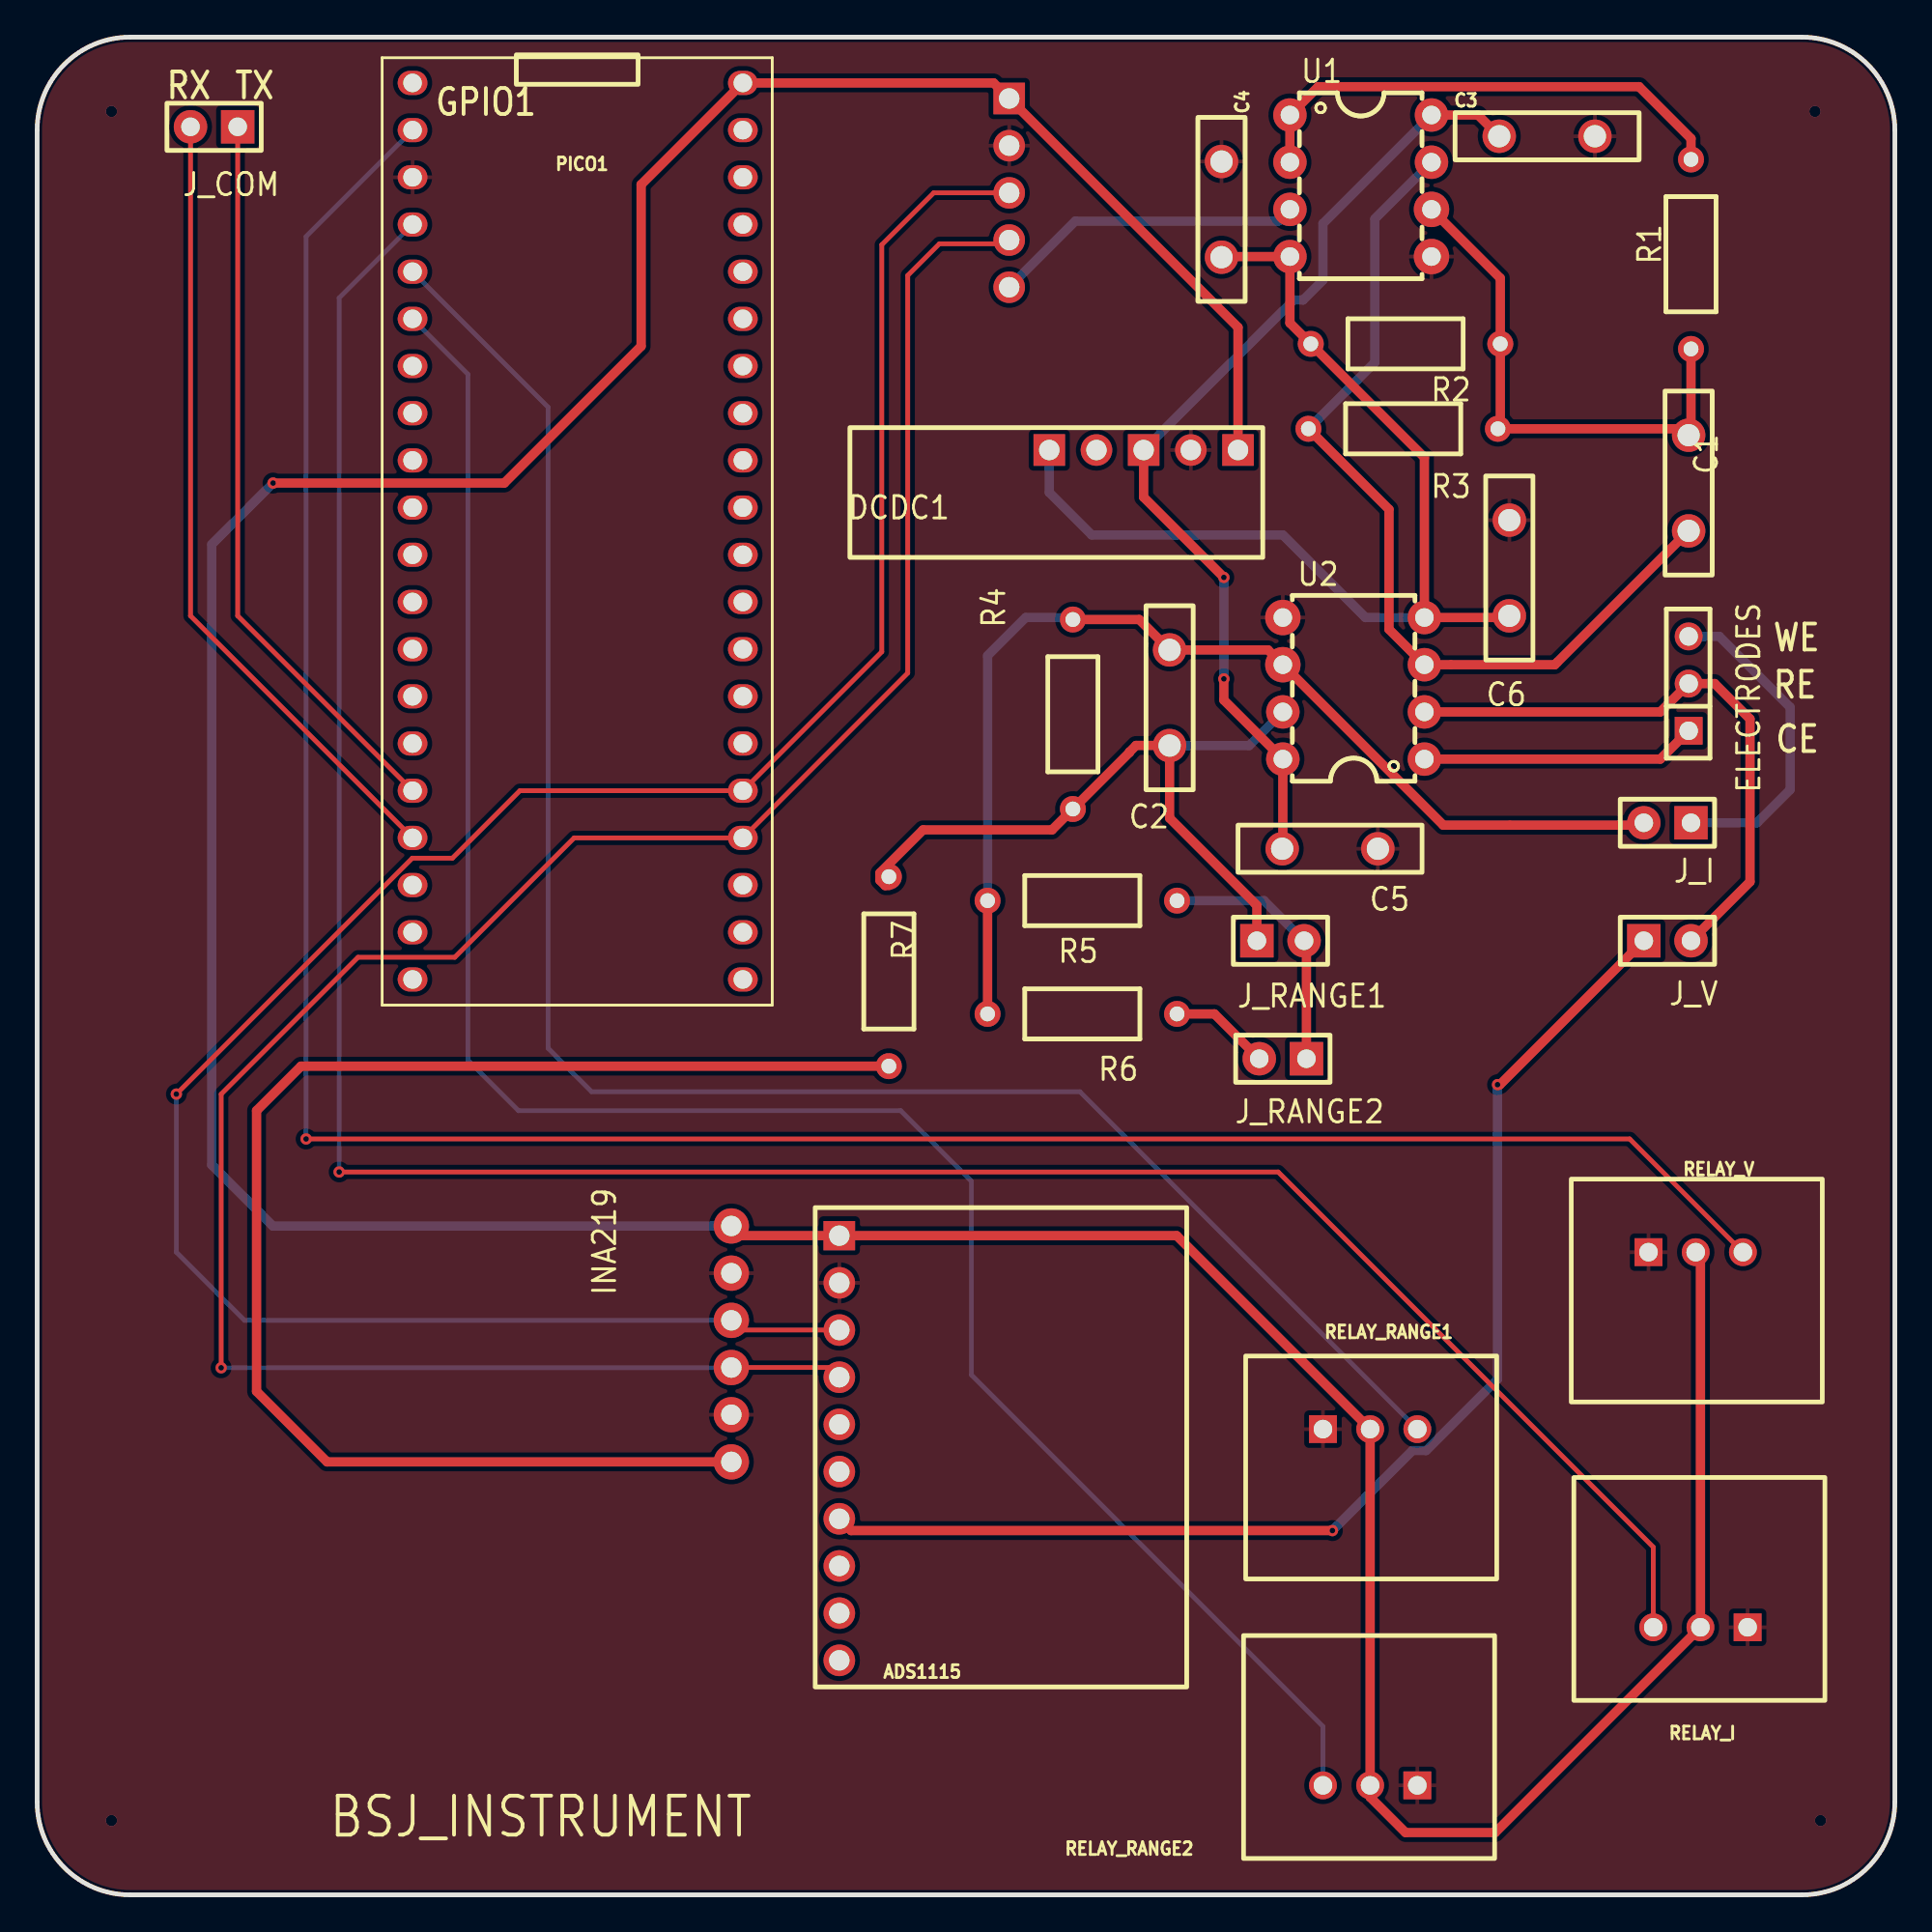
[diagram p3: board, top side]
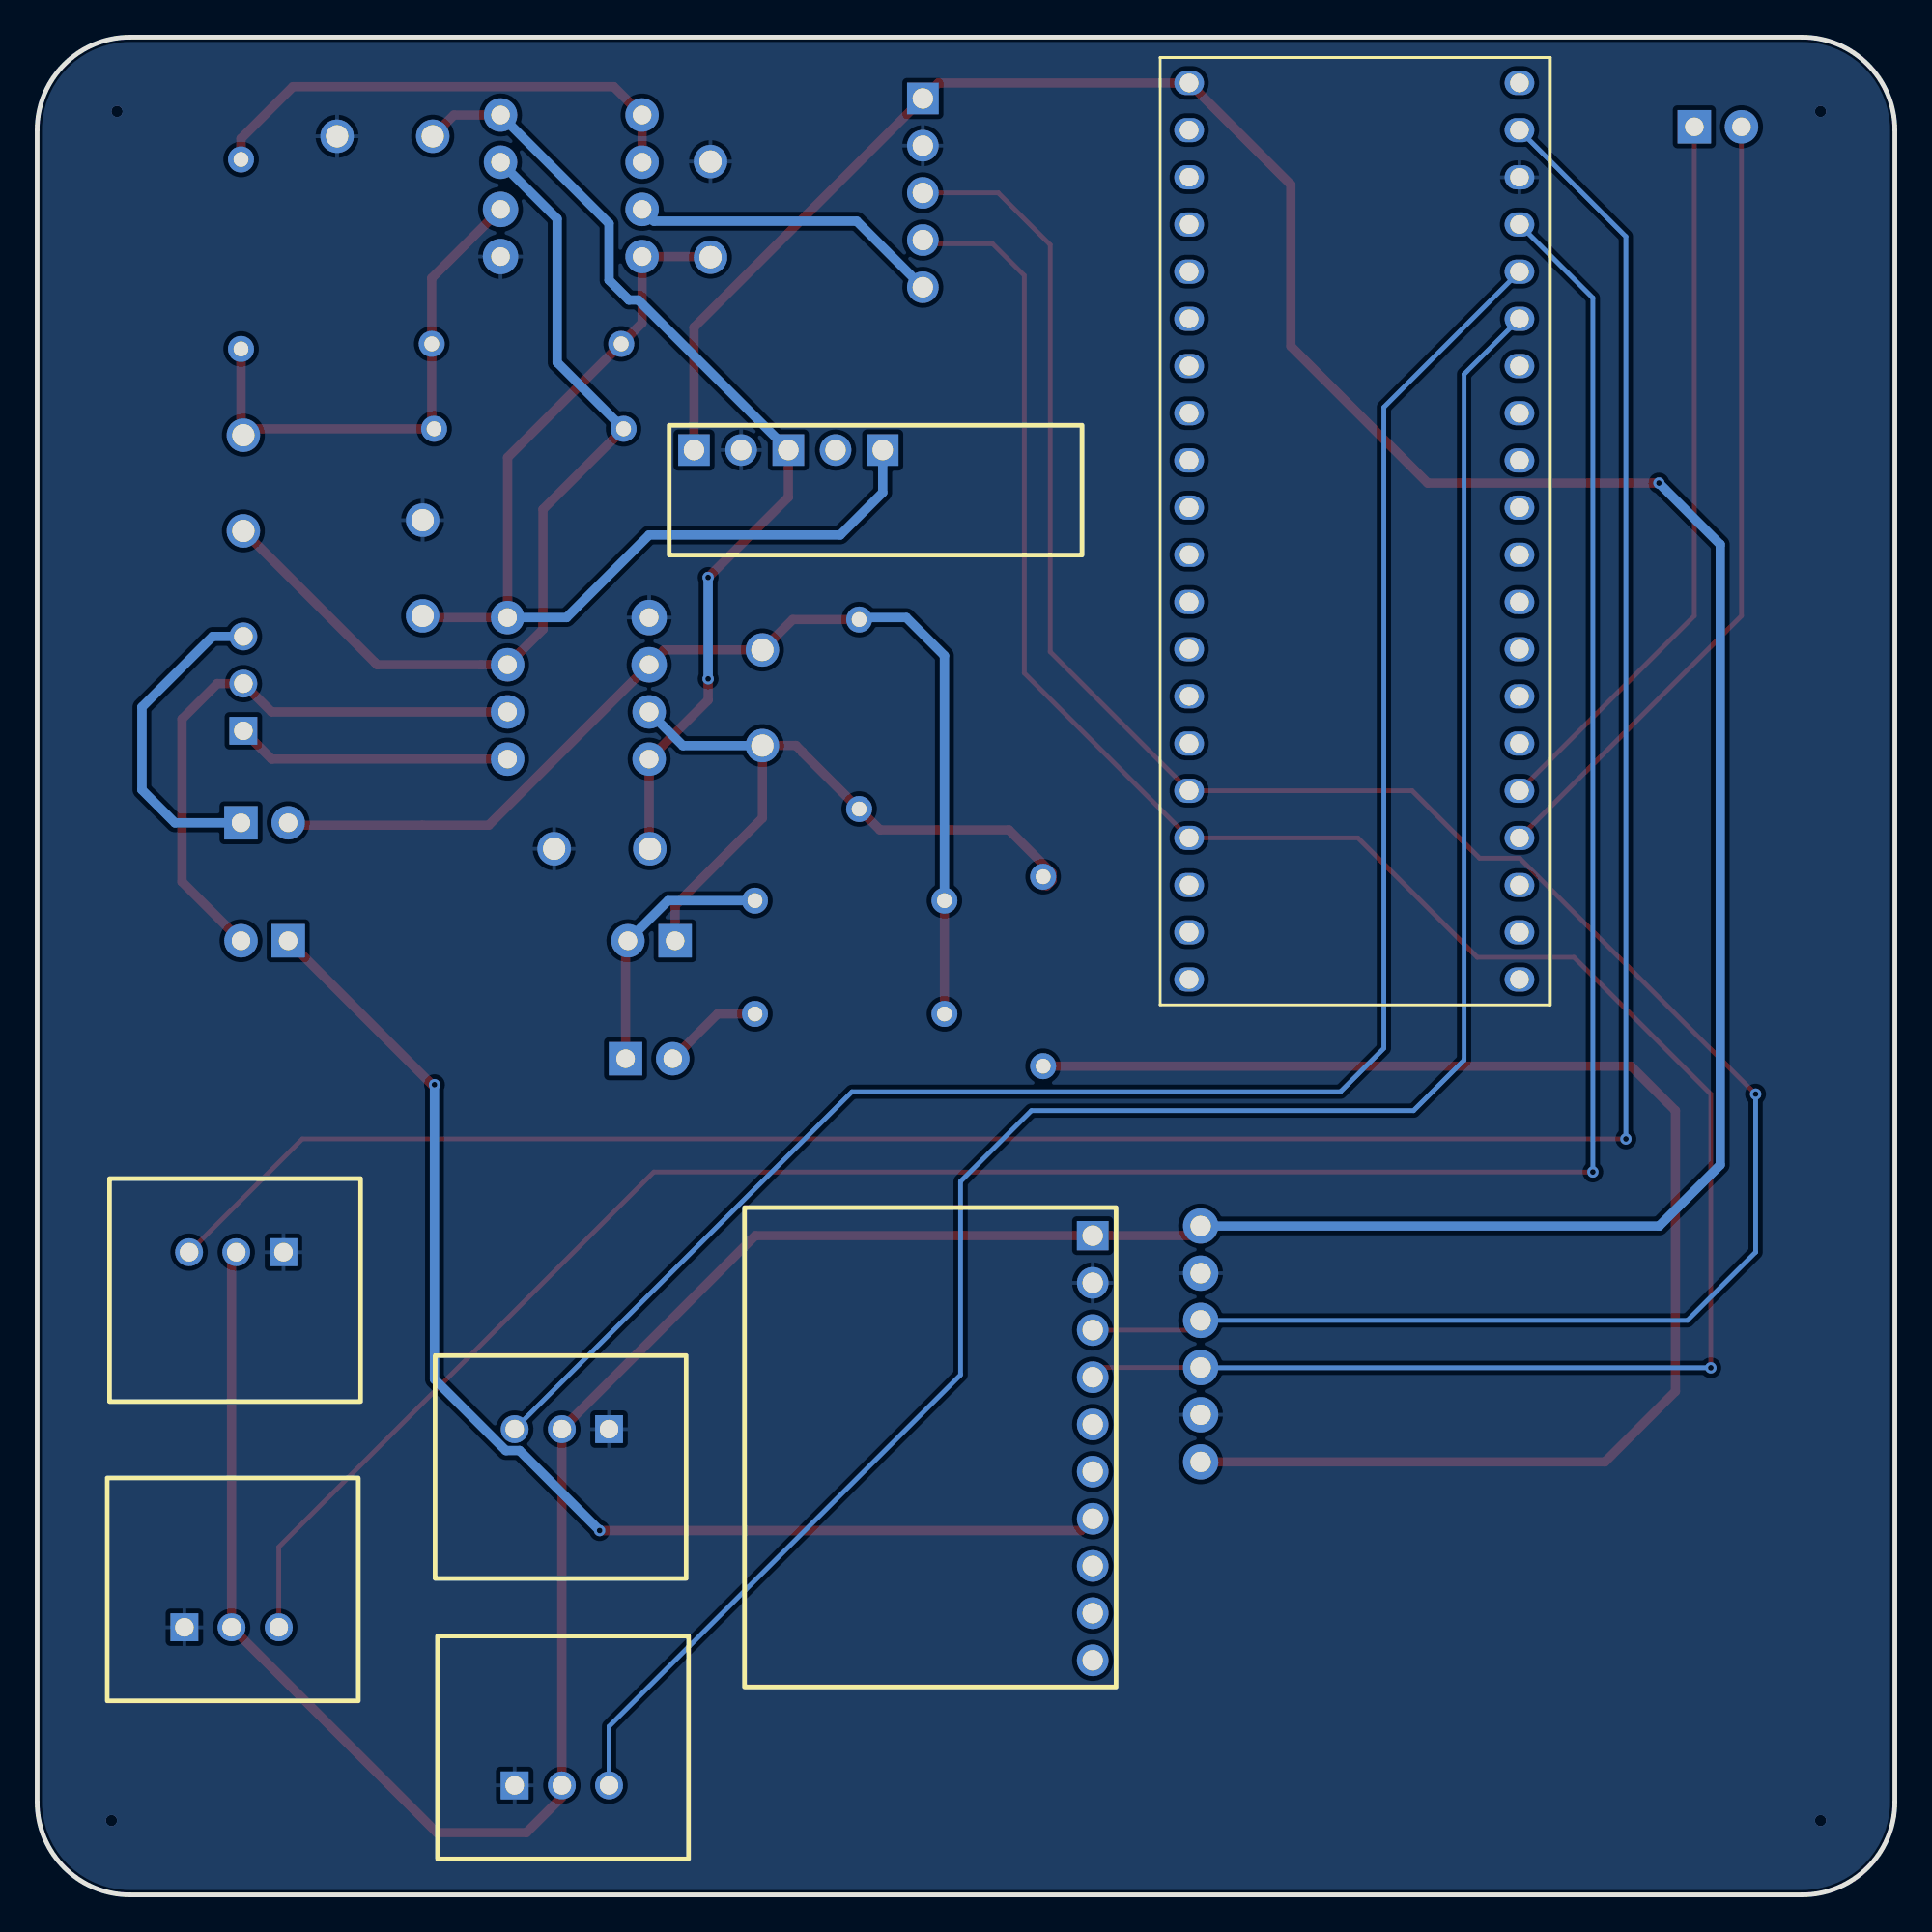
[diagram p4: board, bottom side, seen from below]

Outline 100 x 100 mm; copper layers: Top Layer, Bottom Layer. Coordinates in mm from the lower left corner of the outline.
Outline path: 0,95 0,5 arc(1.46,1.46) 5,0 95,0 arc(98.54,1.46) 100,5 100,95 arc(98.54,98.54) 95,100 5,100 arc(1.46,98.54) 0,95
Stack: Top Layer 0.035mm / Dielectric1 1.51mm FR4 er 4.5 / Bottom Layer 0.035mm

## Design rules (mm)
template: JLCPCB Capability(Two Layers Board)
spacing copperThickness1oz (default): track to track 0.102, other pairs 0.152 to 0.3
spacing copperThickness2oz: track to track 0.203, other pairs 0.152 to 0.3
track width copperThickness1oz (default): min 0.127, default 0.254, max 2.54
track width copperThickness2oz: min 0.203, default 0.254, max 2.54
differential pair differentialPair (default): width min 0.127, default 0.254, max 2.54; gap min 0.152, default 0.152
via viaSize (default): diameter min 0.5, default 0.61, max 10; hole min 0.3, default 0.305, max 6.3

## Placement (name value [footprint] x y rotation side)
ADS1115  HDR1X10  [ADS1115Module]  43.18 24.05 270 top
C1  68nF  [CAP-TH_L10.0-W2.5-P5.15-D0.8]  88.9 76 270 top
C2  100nF  [CAP-TH_L10.0-W2.5-P5.15-D0.8]  60.96 64.44 270 top
C3  0.1uF  [CAP-TH_L10.0-W2.5-P5.15-D0.8]  81.28 94.67 0 top
C4  0.1uF  [CAP-TH_L10.0-W2.5-P5.15-D0.8]  63.75 90.73 270 top
C5  0.1uF  [CAP-TH_L10.0-W2.5-P5.15-D0.8]  69.6 56.31 0 top
C6  0.1uF  [CAP-TH_L10.0-W2.5-P5.15-D0.8]  79.25 71.42 90 top
DCDC1  PZ254V-11-05P  [DCDCModule]  59.56 77.78 0 top
ELECTRODES  排母2.54mm 1X3pin  [HDR-TH_3P-P2.54_CS-1165SDIG]  88.9 65.2 90 top
INA219  KH-2.54FH90-1X6P-H8.5  [INA219Module]  38.86 46.41 270 top
J_COM  HDR1X2  [HDR-TH_2P-P2.54-V-M-1]  9.53 95.17 180 top
J_I  HDR1X2  [HDR-TH_2P-P2.54-V-M-1]  87.76 57.71 180 top
J_RANGE1  HDR1X2  [HDR-TH_2P-P2.54-V-M-1]  66.93 51.36 0 top
J_RANGE2  HDR1X2  [HDR-TH_2P-P2.54-V-M-1]  67.06 45.01 180 top
J_V  HDR1X2  [HDR-TH_2P-P2.54-V-M-1]  87.76 51.36 0 top
MCP4725  PZ254V-11-05P  [MCP4725Module]  52.32 91.62 270 top
PICO1  PICO  [PICO直插]  28.96 80.7 270 top
R1  4.7kΩ  [RES-TH_BD2.7-L6.2-P10.20-D0.4]  89.03 88.32 90 top
R2  10kΩ  [RES-TH_BD2.7-L6.2-P10.20-D0.4]  73.66 83.49 180 top
R3  4.7kΩ  [RES-TH_BD2.7-L6.2-P10.20-D0.4]  73.53 78.92 180 top
R4  680kΩ  [RES-TH_BD2.7-L6.2-P10.20-D0.4]  55.75 63.55 270 top
R5  68kΩ  [RES-TH_BD2.7-L6.2-P10.20-D0.4]  56.26 53.52 180 top
R6  6.8kΩ  [RES-TH_BD2.7-L6.2-P10.20-D0.4]  56.26 47.42 0 top
R7  1kΩ  [RES-TH_BD2.7-L6.2-P10.20-D0.4]  45.85 49.71 270 top
RELAY_I  排母2.54mm 1X3pin  [RELAYModule]  89.53 14.4 180 top
RELAY_RANGE1  排母2.54mm 1X3pin  [RELAYModule]  71.75 25.07 0 top
RELAY_RANGE2  排母2.54mm 1X3pin  [RELAYModule]  71.75 5.89 180 top
RELAY_V  排母2.54mm 1X3pin  [RELAYModule]  89.28 34.59 0 top
U1  OP297  [PDIP-8_L9.6-W6.4-P2.54-LS7.6-BL-1]  71.25 92 270 top
U2  OP297  [PDIP-8_L9.6-W6.4-P2.54-LS7.6-BL-1]  70.87 64.95 90 top

## Footprints (pads in the part's own frame, mm; a bottom-side part is the same pattern mirrored in y, then rotated)
ADS1115Module
  rect 1.575x1.7 hole 1.1: 1(-11.43,0)
  round 1.7 hole 1.1: 2(-8.89,0) 3(-6.35,0) 4(-3.81,0) 5(-1.27,0) 6(1.27,0) 7(3.81,0) 8(6.35,0) 9(8.89,0) 10(11.43,0)
CAP-TH_L10.0-W2.5-P5.15-D0.8
  round 1.8 hole 1.2: 1(-2.575,0) 2(2.575,0)
DCDCModule
  rect 1.7x1.7 hole 1.1: 1(-5.08,0) 3(0,0) 5(5.08,0)
  round 1.7 hole 1.1: 2(-2.54,0) 4(2.54,0)
HDR-TH_2P-P2.54-V-M-1
  rect 1.8x1.8 hole 1: 1(-1.27,0)
  round 1.8 hole 1: 2(1.27,0)
HDR-TH_3P-P2.54_CS-1165SDIG
  rect 1.5x1.5 hole 1: 1(-2.54,0)
  round 1.5 hole 1: 2(0,0) 3(2.54,0)
INA219Module
  round 1.9 hole 1.1: 1(10.4,-1.494) 2(12.94,-1.494) 3(15.48,-1.494) 4(18.02,-1.494) 5(20.56,-1.494) 6(23.1,-1.494)
MCP4725Module
  rect 1.7x1.7 hole 1.1: 1(-5.08,0)
  round 1.7 hole 1.1: 2(-2.54,0) 3(0,0) 4(2.54,0) 5(5.08,0)
PDIP-8_L9.6-W6.4-P2.54-LS7.6-BL-1
  round 1.8 hole 1: 1(-3.81,-3.81) 2(-1.27,-3.81) 3(1.27,-3.81) 4(3.81,-3.81) 7(-1.27,3.81) 8(-3.81,3.81)
  round 1.905 hole 1: 5(3.81,3.81) 6(1.27,3.81)
PICO直插
  oval 1.3x1.6 hole 1: 1(-16.84,-8.748) 2(-14.3,-8.748) 3(-11.76,-8.748) 4(-9.22,-8.748) 5(-6.68,-8.748) 6(-4.14,-8.748) 7(-1.6,-8.748) 8(0.94,-8.748) 9(3.48,-8.748) 10(6.02,-8.748) 11(8.56,-8.748) 12(11.1,-8.748) 13(13.64,-8.748) 14(16.18,-8.748) 15(18.72,-8.748) 16(21.26,-8.748) 17(23.8,-8.748) 18(26.34,-8.748) 19(28.88,-8.748) 20(31.42,-8.748) 21(31.42,9.032) 22(28.88,9.032) 23(26.34,9.032) 24(23.8,9.032) 25(21.26,9.032) 26(18.72,9.032) 27(16.18,9.032) 28(13.64,9.032) 29(11.1,9.032) 30(8.56,9.032) 31(6.02,9.032) 32(3.48,9.032) 33(0.94,9.032) 34(-1.6,9.032) 35(-4.14,9.032) 36(-6.68,9.032) 37(-9.22,9.032) 38(-11.76,9.032) 39(-14.3,9.032) 40(-16.84,9.032)
RELAYModule
  rect 1.5x1.5 hole 1: 1(-2.54,0)
  round 1.5 hole 1: 2(0,0) 3(2.54,0)
RES-TH_BD2.7-L6.2-P10.20-D0.4
  round 1.4 hole 0.8: 1(-5.1,0) 2(5.1,0)

## Nets
As in the schematic.

Pads without a net: ADS1115 5 6 8 9 10; DCDC1 2; PICO1 1 7 8 9 10 11 12 13 14 15 18 19 20 21 22 23 26 27 28 29 30 31 32 33 34 35 36 37 38 39

## Via types
v1: diameter 0.61, hole 0.305, Top Layer to Bottom Layer, 9 vias
v2: diameter 0.61, hole 4, Top Layer to Bottom Layer, 4 vias

## Routing (per net, layer and track width the routed paths; a pad name or vN(x,y) marks a point on that pad's centre or on a via; arc(x,y) is an arc through that point)
GND:
  vias: v2(4,96) v2(4,4) v2(95.7,96) v2(96,4)
V1: length 28.5
  Top Layer w0.5: 75.06,90.73 78.76,87.03 R2.1 78.76,79.05 R3.1 88.55,78.92 C1.1 89.03,78.7 R1.1
V6+: length 53.5
  Top Layer w0.5: C3.1 77.56,95.81 75.06,95.81 ; 67.02,56.31 67.06,56.35 U2.8 63.88,64.31 v1(63.88,65.46) ; DCDC1.3 59.56,75.23 v1(63.88,70.92)
  Bottom Layer w0.5: 75.06,95.81 69.22,89.97 69.22,86.92 68.15,85.85 67.64,85.85 DCDC1.3 ; v1(63.88,65.46) v1(63.88,70.92)
V6-: length 56
  Top Layer w0.5: C4.2 63.79,88.19 U1.4 67.44,84.61 R2.2 74.68,77.37 U2.4 79.16,68.76 C6.1
  Bottom Layer w0.5: 54.48,77.78 54.48,75.49 56.77,73.2 67.06,73.2 71.5,68.76 U2.4
VCC: length 247.6
  Top Layer w0.5: DCDC1.5 64.64,84.38 MCP4725.1 51.49,97.54 PICO1.40 32.51,92.06 32.51,83.36 25.15,76 v1(12.7,76) ; RELAY_V.2 89.53,34.34 RELAY_I.2 78.49,3.35 73.66,3.35 71.75,5.26 RELAY_RANGE2.2 RELAY_RANGE1.2 61.34,35.48 ADS1115.1 37.89,35.48 INA219.1
  Bottom Layer w0.5: INA219.1 12.69,36.01 9.4,39.29 9.4,72.69 v1(12.7,76)
I_IN: length 77.3
  Top Layer w0.5: INA219.6 15.61,23.31 11.81,27.1 11.81,42.22 14.2,44.61 R7.2
I_SWITCH: length 136.1
  Top Layer w0.254: v1(16.26,38.91) 66.8,38.91 87,18.72 RELAY_I.3
  Bottom Layer w0.254: v1(16.26,38.91) 16.26,85.96 PICO1.4
RANGE1: length 100.1
  Bottom Layer w0.254: PICO1.5 27.51,80.08 27.51,45.57 29.84,43.23 56.13,43.23 RELAY_RANGE1.3
RANGE2: length 111.3
  Bottom Layer w0.254: RELAY_RANGE2.3 69.22,9.07 50.29,27.99 50.29,38.41 46.48,42.22 25.91,42.22 23.19,44.93 23.19,81.86 PICO1.6
RX: length 43.2
  Top Layer w0.254: PICO1.17 8.25,68.85 J_COM.2
SCL: length 123.7
  Top Layer w0.254: ADS1115.3 37.89,30.4 INA219.3 ; v1(7.49,43.1) 20.19,55.8 22.35,55.8 25.98,59.44 PICO1.25 45.47,66.91 45.47,88.82 48.26,91.62 MCP4725.3
  Bottom Layer w0.254: v1(7.49,43.1) 7.49,34.59 11.16,30.93 INA219.3
SDA: length 122.2
  Top Layer w0.254: MCP4725.4 52.12,88.88 48.57,88.88 46.86,87.17 46.86,65.77 PICO1.24 28.91,56.9 22.48,50.47 17.27,50.47 9.91,43.1 v1(9.91,28.37) ; INA219.4 42.66,28.39 ADS1115.4
  Bottom Layer w0.254: v1(9.91,28.37) 37.35,28.37 INA219.4
TX: length 39.6
  Top Layer w0.254: J_COM.1 10.8,68.85 PICO1.16
V_CE: length 14.9
  Top Layer w0.5: U2.1 87.38,61.14 ELECTRODES.1
V_OUT: length 49.6
  Top Layer w0.5: C1.2 81.7,66.22 U2.3 72.77,68.12 72.77,74.58 R3.2
  Bottom Layer w0.5: 75.06,93.27 72.01,90.22 72.01,82.49 R3.2
V_RE: length 32.2
  Top Layer w0.5: J_V.2 92.2,54.53 92.2,63.3 90.3,65.2 ELECTRODES.2 87.38,63.68 U2.2
V_SWITCH: length 136.5
  Top Layer w0.254: v1(14.48,40.69) 85.72,40.69 RELAY_V.3
  Bottom Layer w0.254: v1(14.48,40.69) 14.48,89.27 PICO1.2
V_WE: length 17.6
  Bottom Layer w0.5: J_I.1 92.58,57.71 94.36,59.49 94.36,63.93 90.55,67.74 ELECTRODES.3
VSET: length 16.8
  Bottom Layer w0.5: U1.3 66.8,90.09 55.88,90.09 MCP4725.5
$1N2928: length 27
  Top Layer w0.5: U1.2 U1.1 68.96,97.33 86.23,97.33 89.03,94.54 R1.2
$1N3893: length 60.1
  Top Layer w0.5: R5.2 R6.1 ; R4.1 59.32,68.65 C2.1 66.26,67.02 U2.6 75.69,57.58 86.36,57.58 J_I.2
  Bottom Layer w0.5: R4.1 55.65,68.76 53.21,68.76 51.16,66.71 R5.2
$1N3984: length 38.7
  Top Layer w0.5: J_RANGE1.1 65.66,53.26 60.96,57.96 C2.2 60.95,61.87 59.15,61.87 58.8,61.52 58.8,61.5 R4.2 54.63,57.33 47.69,57.33 45.37,55.01 45.37,54.61 45.65,54.33 45.85,54.33
  Bottom Layer w0.5: U2.7 65.24,61.86 C2.2
$1N5030: length 66
  Top Layer w0.5: v1(69.72,19.61) 43.81,19.61 ADS1115.7 ; J_V.1 78.74,43.61 v1(78.61,43.61)
  Bottom Layer w0.5: v1(78.61,43.61) 78.61,27.76 74.77,23.92 74.03,23.92 v1(69.72,19.61)
$1N11195: length 14.1
  Top Layer w0.5: J_RANGE1.2 68.33,51.23 J_RANGE2.1
  Bottom Layer w0.5: J_RANGE1.2 66.04,53.52 R5.1
$1N11201: length 5.4
  Top Layer w0.5: R6.2 63.37,47.42 J_RANGE2.2

## Copper pours and planes (outline as drawn; the poured copper is in the pictures)
GND on Top Layer: -7.62,103.56 108.71,103.56 108.71,-4.78 -7.62,-4.78
GND on Bottom Layer: -7.37,103.56 107.44,103.56 107.44,-4.01 -7.37,-4.01

## Text on the board
Top Silkscreen Layer: RX | TX | GPIO1 | WE | RE | CE | BSJ_INSTRUMENT

# Board PCB1_1
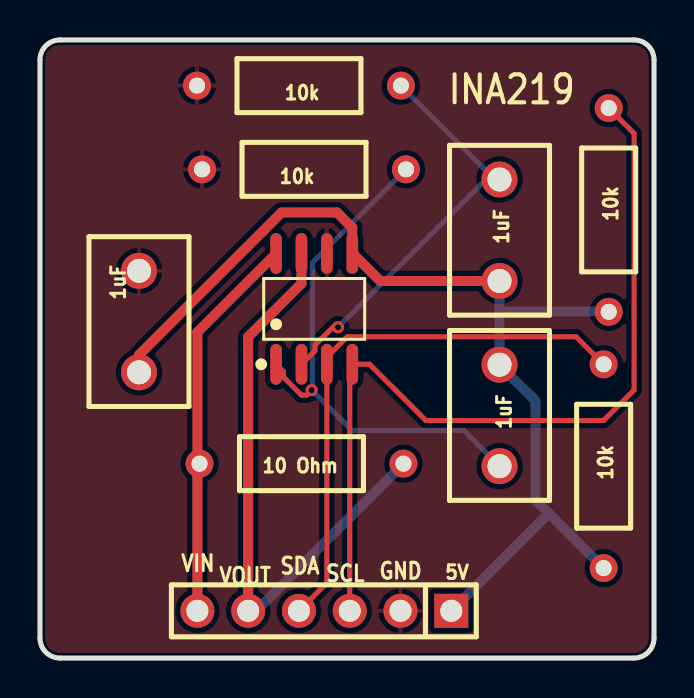
[diagram p5: board, top side]
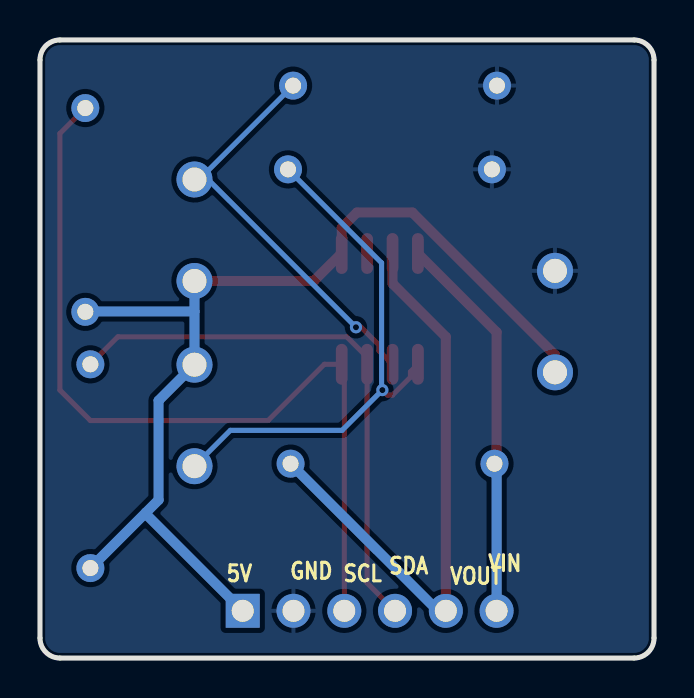
[diagram p6: board, bottom side, seen from below]

Outline 30.72 x 30.94 mm; copper layers: Top Layer, Bottom Layer. Coordinates in mm from the lower left corner of the outline.
Outline path: 0,29.94 0,1 arc(0.29,0.29) 1,0 29.72,0 arc(30.42,0.29) 30.72,1 30.72,29.94 arc(30.42,30.65) 29.72,30.94 1,30.94 arc(0.29,30.65) 0,29.94
Stack: Top Layer 0.035mm / Dielectric1 1.51mm FR4 er 4.5 / Bottom Layer 0.035mm

## Design rules (mm)
template: JLCPCB Capability(Two Layers Board)
spacing copperThickness1oz (default): track to track 0.102, other pairs 0.152 to 0.3
spacing copperThickness2oz: track to track 0.203, other pairs 0.152 to 0.3
track width copperThickness1oz (default): min 0.127, default 0.254, max 2.54
track width copperThickness2oz: min 0.203, default 0.254, max 2.54
differential pair differentialPair (default): width min 0.127, default 0.254, max 2.54; gap min 0.152, default 0.152
via viaSize (default): diameter min 0.5, default 0.61, max 10; hole min 0.3, default 0.305, max 6.3

## Placement (name value [footprint] x y rotation side)
1uF  -  [CAP-TH_L8.5-W5.0-P5.00-D1.2]  22.99 21.41 90 top
1uF#2  -  [CAP-TH_L8.5-W5.0-P5.00-D1.2]  22.99 12.14 270 top
1uF#3  -  [CAP-TH_L8.5-W5.0-P5.00-D1.2]  4.95 16.84 270 top
5V  PZ254V-11-06P  [HDR-TH_6P-P2.54-V-M]  14.22 2.36 180 top
10 Ohm  10Ω  [RES-TH_BD2.7-L6.2-P10.20-D0.4]  13.08 9.73 180 top
10k  -  [RES-TH_BD2.7-L6.2-P10.20-D0.4]  12.95 28.65 180 top
10k#2  -  [RES-TH_BD2.7-L6.2-P10.20-D0.4]  13.21 24.46 180 top
10k#3  -  [RES-TH_BD2.7-L6.2-P10.20-D0.4]  28.45 22.43 90 top
10k#4  -  [RES-TH_BD2.7-L6.2-P10.20-D0.4]  28.19 9.6 90 top
U1  INA219AIDCNR  [SOIC-8_L4.9-W3.9-P1.27-LS6.0-BL]  13.72 17.48 0 top

## Footprints (pads in the part's own frame, mm; a bottom-side part is the same pattern mirrored in y, then rotated)
CAP-TH_L8.5-W5.0-P5.00-D1.2
  round 1.8 hole 1.2: 1(-2.54,0) 2(2.54,0)
HDR-TH_6P-P2.54-V-M
  rect 1.7x1.7 hole 1.1: 1(-6.35,0)
  round 1.7 hole 1.1: 2(-3.81,0) 3(-1.27,0) 4(1.27,0) 5(3.81,0) 6(6.35,0)
RES-TH_BD2.7-L6.2-P10.20-D0.4
  round 1.4 hole 0.8: 1(-5.1,0) 2(5.1,0)
SOIC-8_L4.9-W3.9-P1.27-LS6.0-BL
  oval 0.588x2.045 smd: 1(-1.905,-2.772) 2(-0.635,-2.772) 3(0.635,-2.772) 4(1.905,-2.772) 5(1.905,2.772) 6(0.635,2.772) 7(-0.635,2.772) 8(-1.905,2.772)

## Nets
+5V: 1uF.1 1uF#2.1 1uF#3.2 5V.1 10k#3.1 10k#4.1 U1.5
GND: 1uF#3.1 5V.2 10k.2 10k#2.2 U1.6
VIN: 5V.6 10 Ohm.2 U1.8
SCL: 5V.3 10k#3.2 U1.4
SDA: 5V.4 10k#4.2 U1.3
VOUT: 5V.5 10 Ohm.1 U1.7
$1N4: 1uF#2.2 10k#2.1 U1.1
$1N5: 1uF.2 10k.1 U1.2

## Via types
v1: diameter 0.61, hole 0.305, Top Layer to Bottom Layer, 2 vias

## Routing (per net, layer and track width the routed paths; a pad name or vN(x,y) marks a point on that pad's centre or on a via; arc(x,y) is an arc through that point)
+5V: length 53
  Top Layer w0.5: 22.99,18.87 17.02,18.87 15.64,20.25 U1.5 15.62,21.54 14.86,22.3 12.09,22.3 4.95,15.17 1uF#3.2
  Bottom Layer w0.5: 22.99,17.35 1uF#2.1 24.78,12.89 24.78,7.91 25.41,7.29 ; 22.99,17.35 22.99,18.87 ; 22.99,17.35 28.43,17.35 10k#3.1 ; 25.41,7.29 25.41,7.2 5V.1 ; 25.41,7.29 10k#4.1
VIN: length 26.9
  Top Layer w0.5: U1.8 7.87,16.31 5V.6
  Bottom Layer w0.5: 5V.6 7.87,9.62 10 Ohm.2
SCL: length 42.9
  Top Layer w0.254: 10k#3.2 29.72,26.26 29.72,13.41 28.19,11.89 19.3,11.89 16.49,14.7 U1.4 15.49,14.58 5V.3
SDA: length 28.1
  Top Layer w0.254: 10k#4.2 26.82,16.08 15.37,16.08 14.35,15.06 U1.3 14.35,3.76 5V.4
VOUT: length 29.8
  Top Layer w0.5: 13.08,20.25 13.08,18.75 10.41,16.08 5V.5
  Bottom Layer w0.5: 5V.5 10.81,2.36 10 Ohm.1
$1N4: length 26.7
  Top Layer w0.254: v1(13.59,13.41) 13.34,13.16 13.08,13.16 12.18,14.06 12.18,14.33 U1.1
  Bottom Layer w0.254: 1uF#2.2 21.19,11.4 15.6,11.4 13.63,13.37 ; 13.63,13.37 v1(13.59,13.41) ; 13.63,13.37 13.63,19.78 10k#2.1
$1N5: length 20.4
  Top Layer w0.254: v1(14.91,16.56) 14.65,16.56 13.76,15.66 13.76,15.38 13.08,14.7
  Bottom Layer w0.254: 1uF.2 22.75,23.95 22.53,24.18 ; 22.53,24.18 10k.1 ; 22.53,24.18 v1(14.91,16.56)

## Copper pours and planes (outline as drawn; the poured copper is in the pictures)
GND on Top Layer: -1.27,32.46 32.13,32.46 32.13,-1.19 -1.27,-1.19
GND on Bottom Layer: -2.16,33.1 32.64,33.1 32.64,-2.21 -2.16,-2.21

## Text on the board
Bottom Silkscreen Layer: VIN | VOUT | SDA | SCL | GND | 5V
Top Silkscreen Layer: VIN | VOUT | SDA | SCL | GND | INA219

# Board PCB1_4
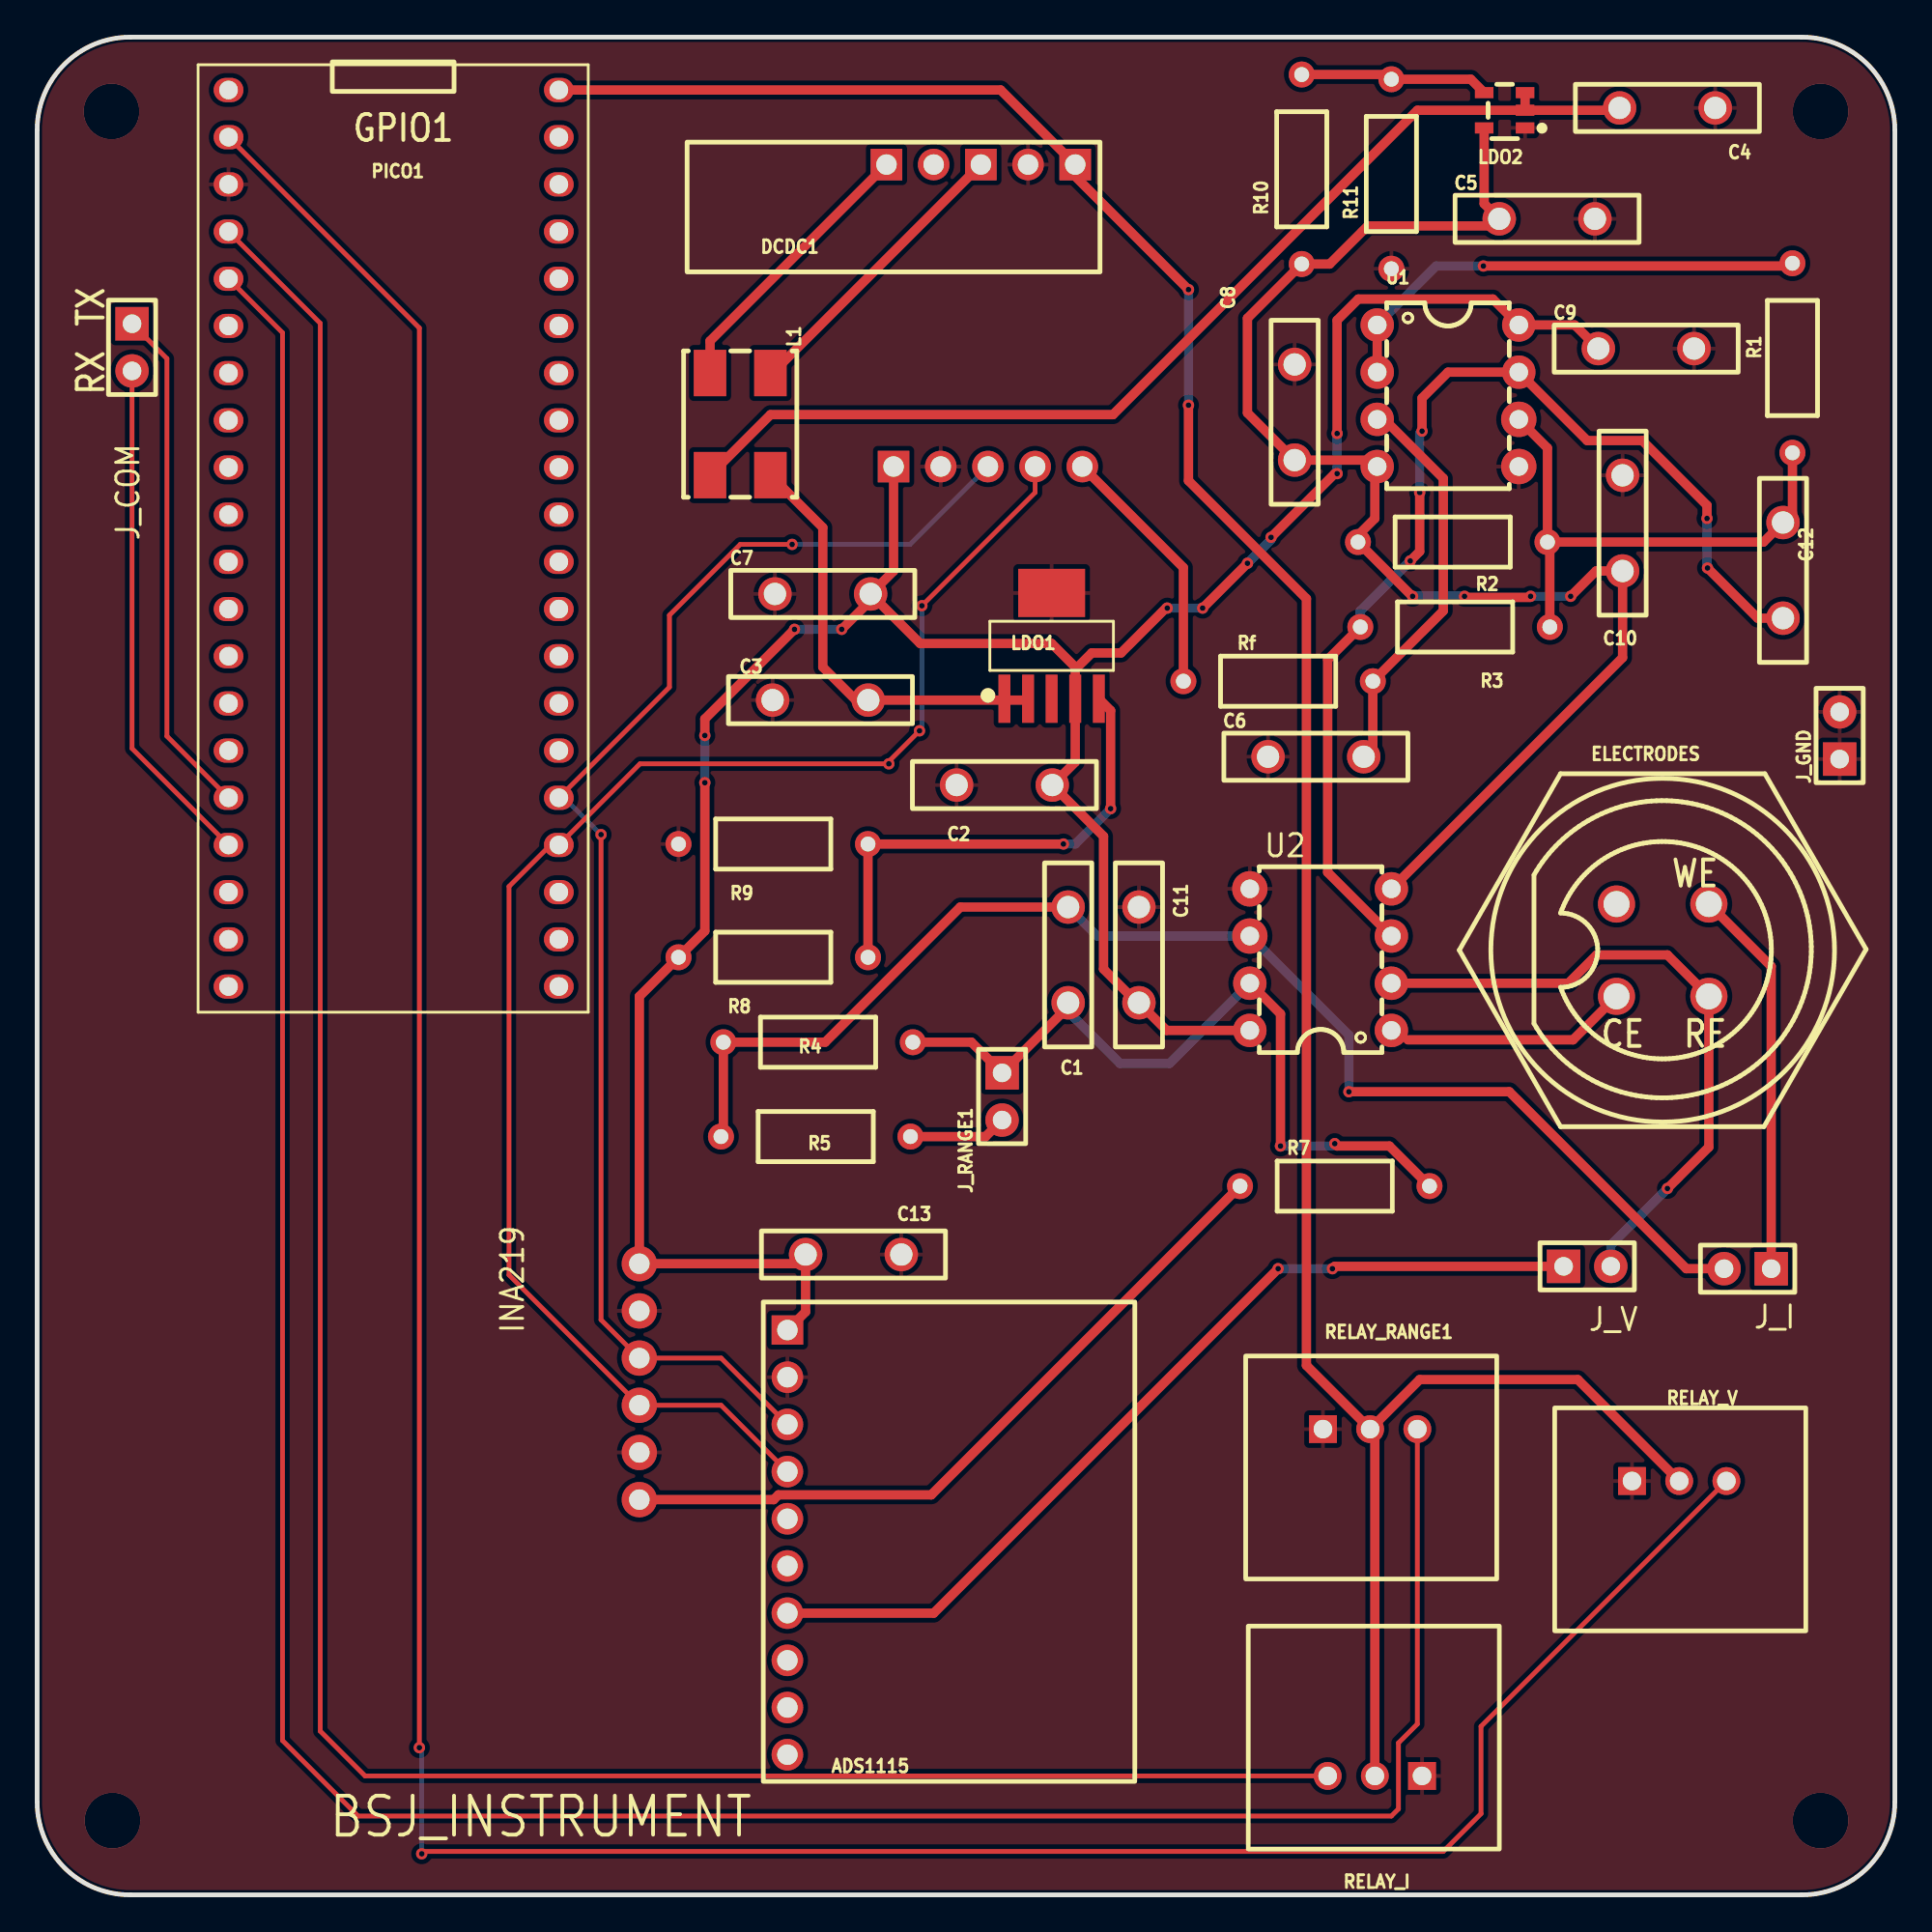
[diagram p7: board, top side]
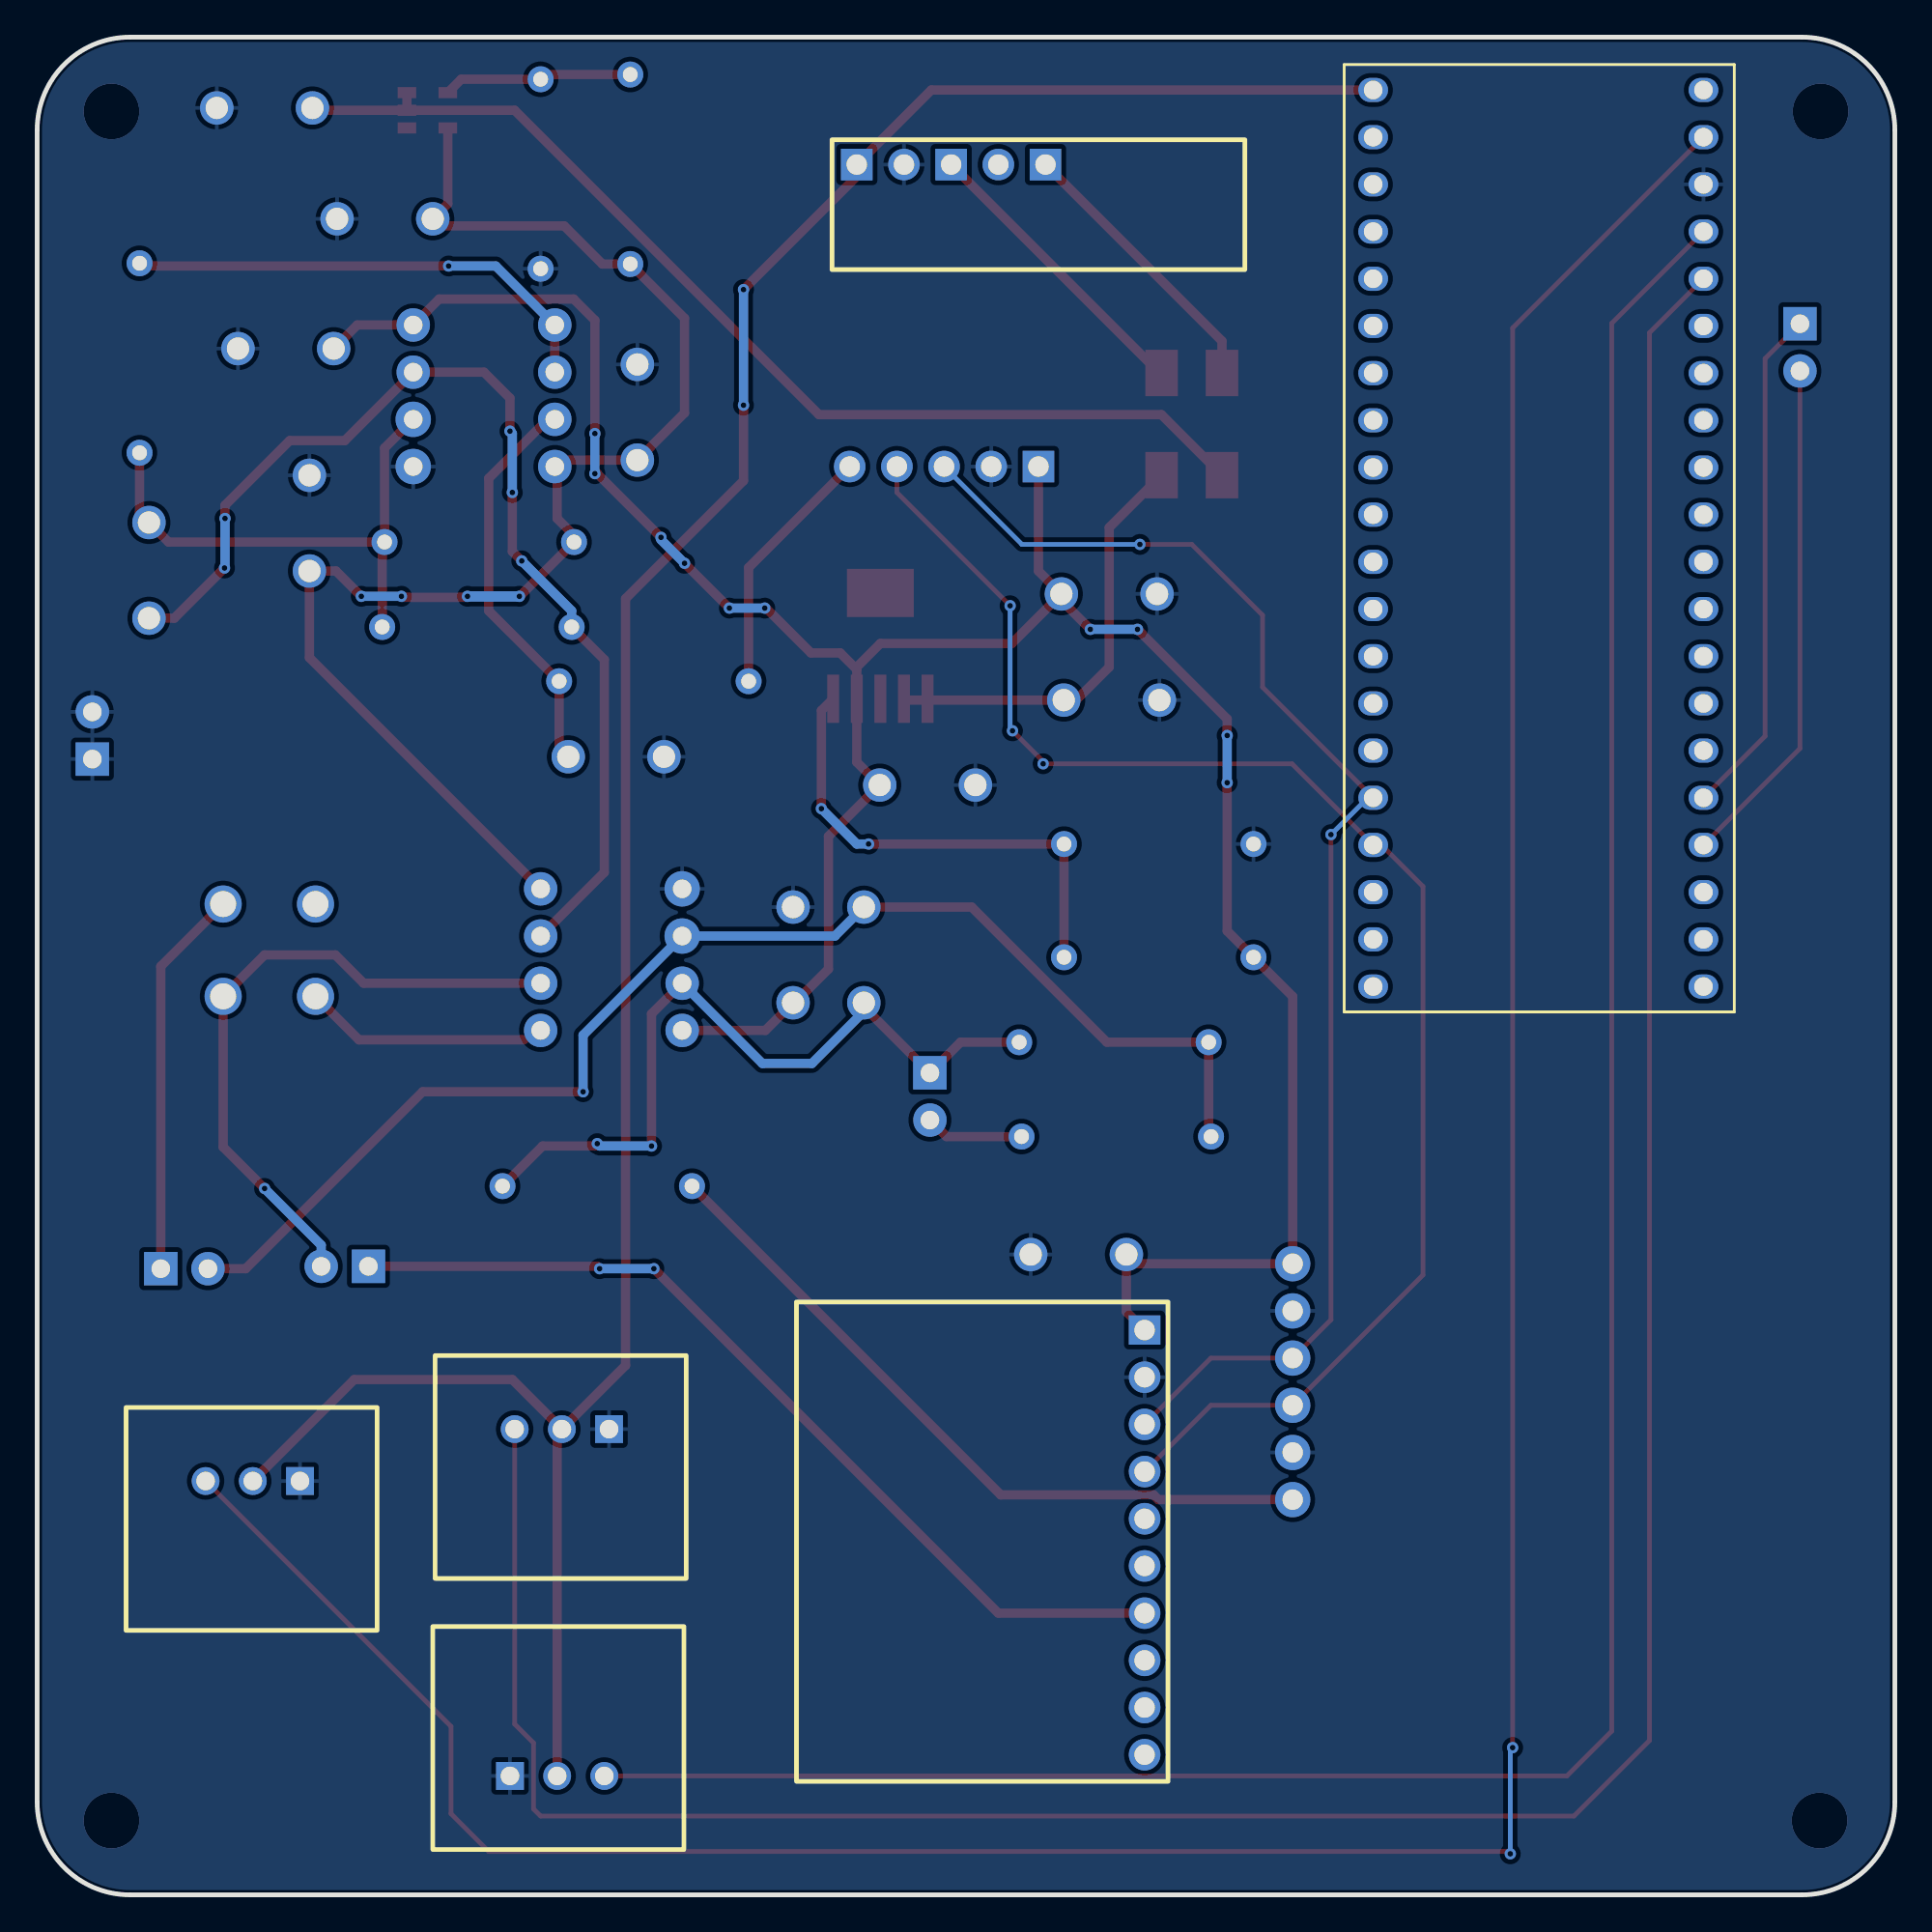
[diagram p8: board, bottom side, seen from below]

Outline 100 x 100 mm; copper layers: Top Layer, Bottom Layer. Coordinates in mm from the lower left corner of the outline.
Outline path: 0,95 0,5 arc(1.46,1.46) 5,0 95,0 arc(98.54,1.46) 100,5 100,95 arc(98.54,98.54) 95,100 5,100 arc(1.46,98.54) 0,95
Stack: Top Layer 0.035mm / Dielectric1 1.51mm FR4 er 4.5 / Bottom Layer 0.035mm

## Design rules (mm)
template: JLCPCB Capability(Two Layers Board)
spacing copperThickness1oz (default): track to track 0.102, other pairs 0.152 to 0.3
spacing copperThickness2oz: track to track 0.203, other pairs 0.152 to 0.3
track width copperThickness1oz (default): min 0.127, default 0.254, max 2.54
track width copperThickness2oz: min 0.203, default 0.254, max 2.54
differential pair differentialPair (default): width min 0.127, default 0.254, max 2.54; gap min 0.152, default 0.152
via viaSize (default): diameter min 0.5, default 0.61, max 10; hole min 0.3, default 0.305, max 6.3

## Placement (name value [footprint] x y rotation side)
ADS1115  HDR1X10  [ADS1115Module]  40.39 18.97 270 top
C1  100nF  [CAP-TH_L10.0-W2.5-P5.15-D0.8]  55.5 50.6 270 top
C2  10uF  [CAP-TH_L10.0-W2.5-P5.15-D0.8]  52.07 59.74 180 top
C3  10uF  [CAP-TH_L10.0-W2.5-P5.15-D0.8]  42.16 64.31 180 top
C4  2.2uF  [CAP-TH_L10.0-W2.5-P5.15-D0.8]  87.76 96.19 0 top
C5  2.2uF  [CAP-TH_L10.0-W2.5-P5.15-D0.8]  81.28 90.22 0 top
C6  0.1uF  [CAP-TH_L10.0-W2.5-P5.15-D0.8]  68.83 61.27 0 top
C7  0.1uF  [CAP-TH_L10.0-W2.5-P5.15-D0.8]  42.29 70.03 0 top
C8  0.1uF  [CAP-TH_L10.0-W2.5-P5.15-D0.8]  67.69 79.81 270 top
C9  0.1uF  [CAP-TH_L10.0-W2.5-P5.15-D0.8]  86.61 83.24 0 top
C10  0.1uF  [CAP-TH_L10.0-W2.5-P5.15-D0.8]  85.34 73.84 90 top
C11  0.1uF  [CAP-TH_L10.0-W2.5-P5.15-D0.8]  59.31 50.6 90 top
C12  68nF  [CAP-TH_L10.0-W2.5-P5.15-D0.8]  93.98 71.3 270 top
C13  0.1uF  [CAP-TH_L10.0-W2.5-P5.15-D0.8]  43.94 34.47 180 top
DCDC1  PZ254V-11-05P  [DCDCModule]  50.8 93.14 0 top
ELECTRODES  XD-GX16-4P-M  [CONN-TH_XD-GX16-4P-M]  87.5 50.85 0 top
INA219  KH-2.54FH90-1X6P-H8.5  [INA219Module]  33.91 44.37 270 top
J_COM  HDR1X2  [HDR-TH_2P-P2.54-V-M-1]  5.11 83.3 270 top
J_GND  HDR1X2  [HDR-TH_2P-P2.54-V-M-1]  97.03 62.41 90 top
J_I  HDR1X2  [HDR-TH_2P-P2.54-V-M-1]  92.07 33.71 180 top
J_RANGE1  HDR1X2  [HDR-TH_2P-P2.54-V-M-1]  51.94 42.98 270 top
J_V  HDR1X2  [HDR-TH_2P-P2.54-V-M-1]  83.44 33.83 0 top
L1  SMCM7060-102T  [FILTER-SMD_4P-L7.0-W6.0-TL_SMCM7060]  37.85 79.17 270 top
LDO1  GM12043AKCZ-R7  [SOT-223-6_L6.5-W3.5-P1.27-LS7.0-BR]  54.61 67.23 270 top
LDO2  GM1206AUJZ-R7  [SOT-23-5_L2.9-W1.6-P0.95-LS2.8-BR]  78.99 96.06 0 top
MCP4725  PZ254V-11-05P  [MCP4725Module]  51.18 76.89 0 top
PICO1  PICO  [PICO直插]  19.05 80.31 270 top
R1  4.7kΩ  [RES-TH_BD2.7-L6.2-P10.20-D0.4]  94.49 82.73 90 top
R2  12kΩ  [RES-TH_BD2.7-L6.2-P10.20-D0.4]  76.2 72.82 180 top
R3  6.8kΩ  [RES-TH_BD2.7-L6.2-P10.20-D0.4]  76.33 68.25 180 top
R4  680kΩ  [RES-TH_BD2.7-L6.2-P10.20-D0.4]  42.04 45.9 0 top
R5  6.8kΩ  [RES-TH_BD2.7-L6.2-P10.20-D0.4]  41.91 40.82 180 top
R7  1kΩ  [RES-TH_BD2.7-L6.2-P10.20-D0.4]  69.85 38.15 180 top
R8  15kΩ  [RES-TH_BD2.7-L6.2-P10.20-D0.4]  39.62 50.47 0 top
R9  4.7kΩ  [RES-TH_BD2.7-L6.2-P10.20-D0.4]  39.62 56.57 180 top
R10  15kΩ  [RES-TH_BD2.7-L6.2-P10.20-D0.4]  68.07 92.89 90 top
R11  4.7kΩ  [RES-TH_BD2.7-L6.2-P10.20-D0.4]  72.9 92.63 270 top
RELAY_I  排母2.54mm 1X3pin  [RELAYModule]  72.01 6.4 180 top
RELAY_RANGE1  排母2.54mm 1X3pin  [RELAYModule]  71.75 25.07 0 top
RELAY_V  排母2.54mm 1X3pin  [RELAYModule]  88.39 22.28 0 top
Rf  10kΩ  [RES-TH_BD2.7-L6.2-P10.20-D0.4]  66.8 65.33 180 top
U1  OP297  [PDIP-8_L9.6-W6.4-P2.54-LS7.6-BL-1]  75.95 80.7 270 top
U2  OP297  [PDIP-8_L9.6-W6.4-P2.54-LS7.6-BL-1]  69.09 50.34 90 top

## Footprints (pads in the part's own frame, mm; a bottom-side part is the same pattern mirrored in y, then rotated)
ADS1115Module
  rect 1.575x1.7 hole 1.1: 1(-11.43,0)
  round 1.7 hole 1.1: 2(-8.89,0) 3(-6.35,0) 4(-3.81,0) 5(-1.27,0) 6(1.27,0) 7(3.81,0) 8(6.35,0) 9(8.89,0) 10(11.43,0)
CAP-TH_L10.0-W2.5-P5.15-D0.8
  round 1.8 hole 1.2: 1(-2.575,0) 2(2.575,0)
CONN-TH_XD-GX16-4P-M
  round 2 hole 1.4: 1(-2.485,-2.485) 2(2.485,-2.485) 3(2.485,2.485) 4(-2.485,2.485)
DCDCModule
  rect 1.7x1.7 hole 1.1: 1(-5.08,0) 3(0,0) 5(5.08,0)
  round 1.7 hole 1.1: 2(-2.54,0) 4(2.54,0)
FILTER-SMD_4P-L7.0-W6.0-TL_SMCM7060
  rect 2.5x1.75 smd: 1(-2.75,1.625) 2(-2.75,-1.625) 3(2.75,-1.625) 4(2.75,1.625)
HDR-TH_2P-P2.54-V-M-1
  rect 1.8x1.8 hole 1: 1(-1.27,0)
  round 1.8 hole 1: 2(1.27,0)
INA219Module
  round 1.9 hole 1.1: 1(10.4,-1.494) 2(12.94,-1.494) 3(15.48,-1.494) 4(18.02,-1.494) 5(20.56,-1.494) 6(23.1,-1.494)
MCP4725Module
  rect 1.7x1.7 hole 1.1: 1(-5.08,0)
  round 1.7 hole 1.1: 2(-2.54,0) 3(0,0) 4(2.54,0) 5(5.08,0)
PDIP-8_L9.6-W6.4-P2.54-LS7.6-BL-1
  round 1.8 hole 1: 1(-3.81,-3.81) 2(-1.27,-3.81) 3(1.27,-3.81) 4(3.81,-3.81) 7(-1.27,3.81) 8(-3.81,3.81)
  round 1.905 hole 1: 5(3.81,3.81) 6(1.27,3.81)
PICO直插
  oval 1.3x1.6 hole 1: 1(-16.84,-8.748) 2(-14.3,-8.748) 3(-11.76,-8.748) 4(-9.22,-8.748) 5(-6.68,-8.748) 6(-4.14,-8.748) 7(-1.6,-8.748) 8(0.94,-8.748) 9(3.48,-8.748) 10(6.02,-8.748) 11(8.56,-8.748) 12(11.1,-8.748) 13(13.64,-8.748) 14(16.18,-8.748) 15(18.72,-8.748) 16(21.26,-8.748) 17(23.8,-8.748) 18(26.34,-8.748) 19(28.88,-8.748) 20(31.42,-8.748) 21(31.42,9.032) 22(28.88,9.032) 23(26.34,9.032) 24(23.8,9.032) 25(21.26,9.032) 26(18.72,9.032) 27(16.18,9.032) 28(13.64,9.032) 29(11.1,9.032) 30(8.56,9.032) 31(6.02,9.032) 32(3.48,9.032) 33(0.94,9.032) 34(-1.6,9.032) 35(-4.14,9.032) 36(-6.68,9.032) 37(-9.22,9.032) 38(-11.76,9.032) 39(-14.3,9.032) 40(-16.84,9.032)
RELAYModule
  rect 1.5x1.5 hole 1: 1(-2.54,0)
  round 1.5 hole 1: 2(0,0) 3(2.54,0)
RES-TH_BD2.7-L6.2-P10.20-D0.4
  round 1.4 hole 0.8: 1(-5.1,0) 2(5.1,0)
SOT-23-5_L2.9-W1.6-P0.95-LS2.8-BR
  rect 1x0.6 smd: 1(1.1,-0.95) 2(1.1,0) 3(1.1,0.95) 4(-1.1,0.95) 5(-1.1,-0.95)
SOT-223-6_L6.5-W3.5-P1.27-LS7.0-BR
  rect 2.595x0.644 smd: 1(2.848,-2.54) 2(2.848,-1.27) 3(2.848,0) 4(2.848,1.27) 5(2.848,2.54)
  rect 2.595x3.6 smd: 6(-2.848,0)

## Nets
As in the schematic.

Pads without a net: ADS1115 5 6 8 9 10; DCDC1 2; ELECTRODES 4; LDO1 3; PICO1 1 6 7 8 9 10 11 12 13 14 15 18 19 20 21 22 23 26 27 28 29 30 31 32 33 34 35 36 37 38 39

## Via types
v1: diameter 0.61, hole 0.305, Top Layer to Bottom Layer, 37 vias
v2: diameter 3, hole 3, Top Layer to Bottom Layer, 4 vias

## Routing (per net, layer and track width the routed paths; a pad name or vN(x,y) marks a point on that pad's centre or on a via; arc(x,y) is an arc through that point)
GND:
  vias: v2(4,96) v2(4.05,4) v2(96,96) v2(96,4)
V1: length 28.9
  Top Layer w0.5: R2.1 92.93,72.82 C12.1 94.49,74.38 R1.1 ; R2.1 81.3,77.88 U1.6 ; R2.1 81.43,72.69 R3.1
V5+: length 145.9
  Top Layer w0.5: v1(66.42,73.08) 69.85,76.5 v1(69.98,76.5) ; C7.2 44.87,69.68 v1(43.31,68.12) ; C7.2 46.1,71.26 MCP4725.1 ; C7.2 47.53,67.36 54.61,67.36 55.88,66.09 55.88,65.96 ; v1(60.83,69.27) 60.76,69.27 58.35,66.85 56.77,66.85 55.88,65.96 ; v1(62.74,69.27) v1(65.15,71.68) ; 55.88,65.96 LDO1.4 55.88,60.98 C2.1 57.4,56.98 57.4,49.83 59.22,48.02 C11.1 60.8,46.53 U2.8 ; v1(35.94,59.87) 35.94,51.89 R8.1 32.41,48.36 INA219.1 40.87,33.97 C13.2 41.37,31.38 ADS1115.1 ; v1(35.94,62.41) 35.94,63.3 v1(40.77,68.12) ; C9.1 82.77,84.51 U1.8 78.36,85.9 71.12,85.9 69.98,84.76 v1(69.98,78.66)
  Bottom Layer w0.5: v1(60.83,69.27) v1(62.74,69.27) ; v1(65.15,71.68) 66.42,72.95 v1(66.42,73.08) ; v1(40.77,68.12) v1(43.31,68.12) ; v1(35.94,59.87) v1(35.94,62.41) ; v1(69.98,76.5) v1(69.98,78.66)
V5-: length 77.1
  Top Layer w0.254: 80.33,69.84 v1(80.39,69.9) ; v1(76.84,69.9) 76.9,69.84
  Top Layer w0.5: U2.4 85.34,66.6 85.34,71.26 83.91,71.26 v1(82.55,69.9) ; LDO2.5 77.89,91.03 C5.1 78.32,89.84 71.63,89.84 69.58,87.79 R10.1 65.15,84.87 65.15,79.77 C8.2 71.79,77.23 U1.4 72.01,76.76 72.01,74.09 71.1,73.18 R2.2 74.02,69.9 v1(74.04,69.9) ; 76.9,69.84 80.33,69.84
  Bottom Layer w0.5: v1(80.39,69.9) v1(82.55,69.9)
  Bottom Layer w0.56: v1(74.04,69.9) 74.05,69.89 76.82,69.89 v1(76.84,69.9)
V6+: length 23.3
  Top Layer w0.5: L1.4 42.29,73.6 42.29,66.09 44.07,64.31 53.27,64.31 LDO1.2
V6-: length 58.1
  Top Layer w0.5: 80.09,97.01 LDO2.2 ; LDO2.2 74.29,96.06 57.91,79.68 39.48,79.68 L1.3 ; LDO2.2 85.06,96.06 C4.1
VCC: length 142.9
  Top Layer w0.254: 55.88,92.51 DCDC1.5
  Top Layer w0.5: RELAY_RANGE1.2 68.33,28.5 68.33,69.77 61.98,76.12 v1(61.98,80.19) ; RELAY_RANGE1.2 72.01,24.82 RELAY_I.2 ; RELAY_RANGE1.2 74.42,27.74 82.93,27.74 RELAY_V.2 ; v1(61.98,86.41) 55.88,92.51 ; PICO1.40 51.87,97.16 DCDC1.5
  Bottom Layer w0.5: v1(61.98,80.19) v1(61.98,86.41)
I_IN: length 39.3
  Top Layer w0.5: R7.2 48.13,21.53 39.9,21.53 39.65,21.27 INA219.6
I_SWITCH: length 138
  Top Layer w0.254: RELAY_I.3 17.65,6.4 15.24,8.81 15.24,84.6 PICO1.4
RANGE1: length 162.7
  Top Layer w0.254: PICO1.5 13.21,84.09 13.21,8.31 17.27,4.24 72.9,4.24 73.28,4.62 73.28,8.18 74.29,9.19 RELAY_RANGE1.3
RX: length 27.7
  Top Layer w0.254: J_COM.2 5.11,61.71 PICO1.17
SCL: length 74.3
  Top Layer w0.254: v1(30.35,57.07) 30.35,30.96 INA219.3 36.82,28.89 ADS1115.3 ; 28.08,59.06 34.04,65.01 34.04,68.89 37.85,72.69 v1(40.64,72.69)
  Bottom Layer w0.254: v1(30.35,57.07) 28.37,59.06 28.08,59.06 ; v1(40.64,72.69) 46.99,72.69 MCP4725.3
SDA: length 82.7
  Top Layer w0.25: MCP4725.4 53.72,75.49 v1(47.62,69.39)
  Top Layer w0.254: ADS1115.4 36.82,26.35 INA219.4 25.4,33.37 25.4,54.28 27.64,56.52 PICO1.24 32.45,60.88 v1(45.85,60.88) 45.85,61.01 v1(47.5,62.66)
  Bottom Layer w0.254: v1(47.62,69.39) 47.62,62.79 v1(47.5,62.66)
TX: length 27.7
  Top Layer w0.254: 10.3,59.06 6.98,62.37 6.98,82.7 J_COM.1
V_CE: length 12.2
  Top Layer w0.5: ELECTRODES.1 82.68,46.03 73.79,46.03
V_OUT: length 59.9
  Top Layer w0.5: U2.3 69.47,55.04 69.47,66.49 R3.2 ; v1(89.89,74.09) 89.89,74.8 86.4,78.28 83.44,78.28 U1.7 75.95,81.97 74.55,80.57 v1(74.55,78.79) ; v1(89.92,71.42) 92.62,68.72 C12.2 ; v1(74.42,75.49) 74.42,72.31 v1(73.91,71.81)
  Bottom Layer w0.5: v1(89.92,71.42) 89.89,71.45 v1(89.89,74.09) ; v1(74.42,75.49) 74.42,78.66 v1(74.55,78.79) ; v1(73.91,71.81) 71.23,69.12 R3.2
V_RE: length 35.4
  Top Layer w0.5: 72.9,49.07 82.42,49.07 83.95,50.6 87.76,50.6 ELECTRODES.2 89.99,40.25 v1(87.76,38.02)
  Bottom Layer w0.5: v1(87.76,38.02) 84.71,34.98 J_V.2
V_SWITCH: length 178
  Top Layer w0.254: v1(20.7,2.21) 20.83,2.34 75.69,2.34 77.72,4.37 77.72,9.07 RELAY_V.3 ; v1(20.57,7.93) 20.57,84.34 PICO1.2
  Bottom Layer w0.254: v1(20.57,7.93) 20.7,7.8 v1(20.7,2.21)
V_WE: length 21
  Top Layer w0.5: ELECTRODES.3 93.34,49.98 J_I.1
VSET: length 21.6
  Top Layer w0.5: U1.3 72.52,79.43 75.69,76.25 75.69,69.12 Rf.1 71.9,61.76 C6.2
$1N2928: length 26.3
  Top Layer w0.5: U1.2 U1.1 ; v1(77.85,87.68) 94.34,87.68 R1.2
  Bottom Layer w0.5: U1.1 75.31,87.68 v1(77.85,87.68)
$1N3893: length 71.9
  Top Layer w0.5: v1(70.61,43.23) 79.25,43.23 88.77,33.71 J_I.2 ; R5.2 36.94,40.94 R4.1 42.42,45.9 49.69,53.17 C1.1
  Bottom Layer w0.5: v1(70.61,43.23) 70.61,46.28 U2.6 57.06,51.61 C1.1
$1N3984: length 42.4
  Top Layer w0.5: v1(66.93,40.31) 66.93,47.42 65.28,49.07 ; v1(69.85,40.44) 69.98,40.31 72.79,40.31 R7.1 ; C1.2 55.5,47.8 J_RANGE1.1 50.29,45.9 R4.2
  Bottom Layer w0.5: v1(66.93,40.31) 69.72,40.31 v1(69.85,40.44) ; 65.28,49.07 60.96,44.75 58.29,44.75 55.5,47.55 C1.2
$1N5030: length 49.5
  Top Layer w0.5: v1(66.8,33.71) 48.26,15.16 ADS1115.7 ; v1(69.72,33.71) 69.85,33.83 J_V.1
  Bottom Layer w0.5: v1(69.72,33.71) v1(66.8,33.71)
$1N11195: length 5.3
  Top Layer w0.5: J_RANGE1.2 51.05,40.82 R5.1
$1N18407: length 15.2
  Top Layer w0.5: DCDC1.1 36.22,83.64 L1.2
$1N18409: length 16
  Top Layer w0.5: DCDC1.3 39.58,81.92 L1.1
$1N19473: length 13.8
  Top Layer w0.5: 56.26,76.89 61.7,71.44 Rf.2
$1N24230: length 26.1
  Top Layer w0.5: v1(57.78,58.47) 57.78,63.75 LDO1.5 ; R8.2 R9.1 v1(55.25,56.57)
  Bottom Layer w0.5: v1(55.25,56.57) 55.88,56.57 v1(57.78,58.47)
$1N24635: length 10.2
  Top Layer w0.5: 77.89,97.01 77.17,97.73 R11.1 72.64,97.99 R10.2

## Copper pours and planes (outline as drawn; the poured copper is in the pictures)
GND on Top Layer: -8.38,103.81 108.2,103.81 108.2,-5.66 -8.38,-5.66
GND on Bottom Layer: -8.38,104.06 108.84,104.06 108.84,-5.41 -8.38,-5.41

## Text on the board
Top Silkscreen Layer: GPIO1 | CE | WE | RE | TX | RX | BSJ_INSTRUMENT
